# EAGLE design BeaverBoard (EAGLE 5.11)

## Sheet 1 of 5
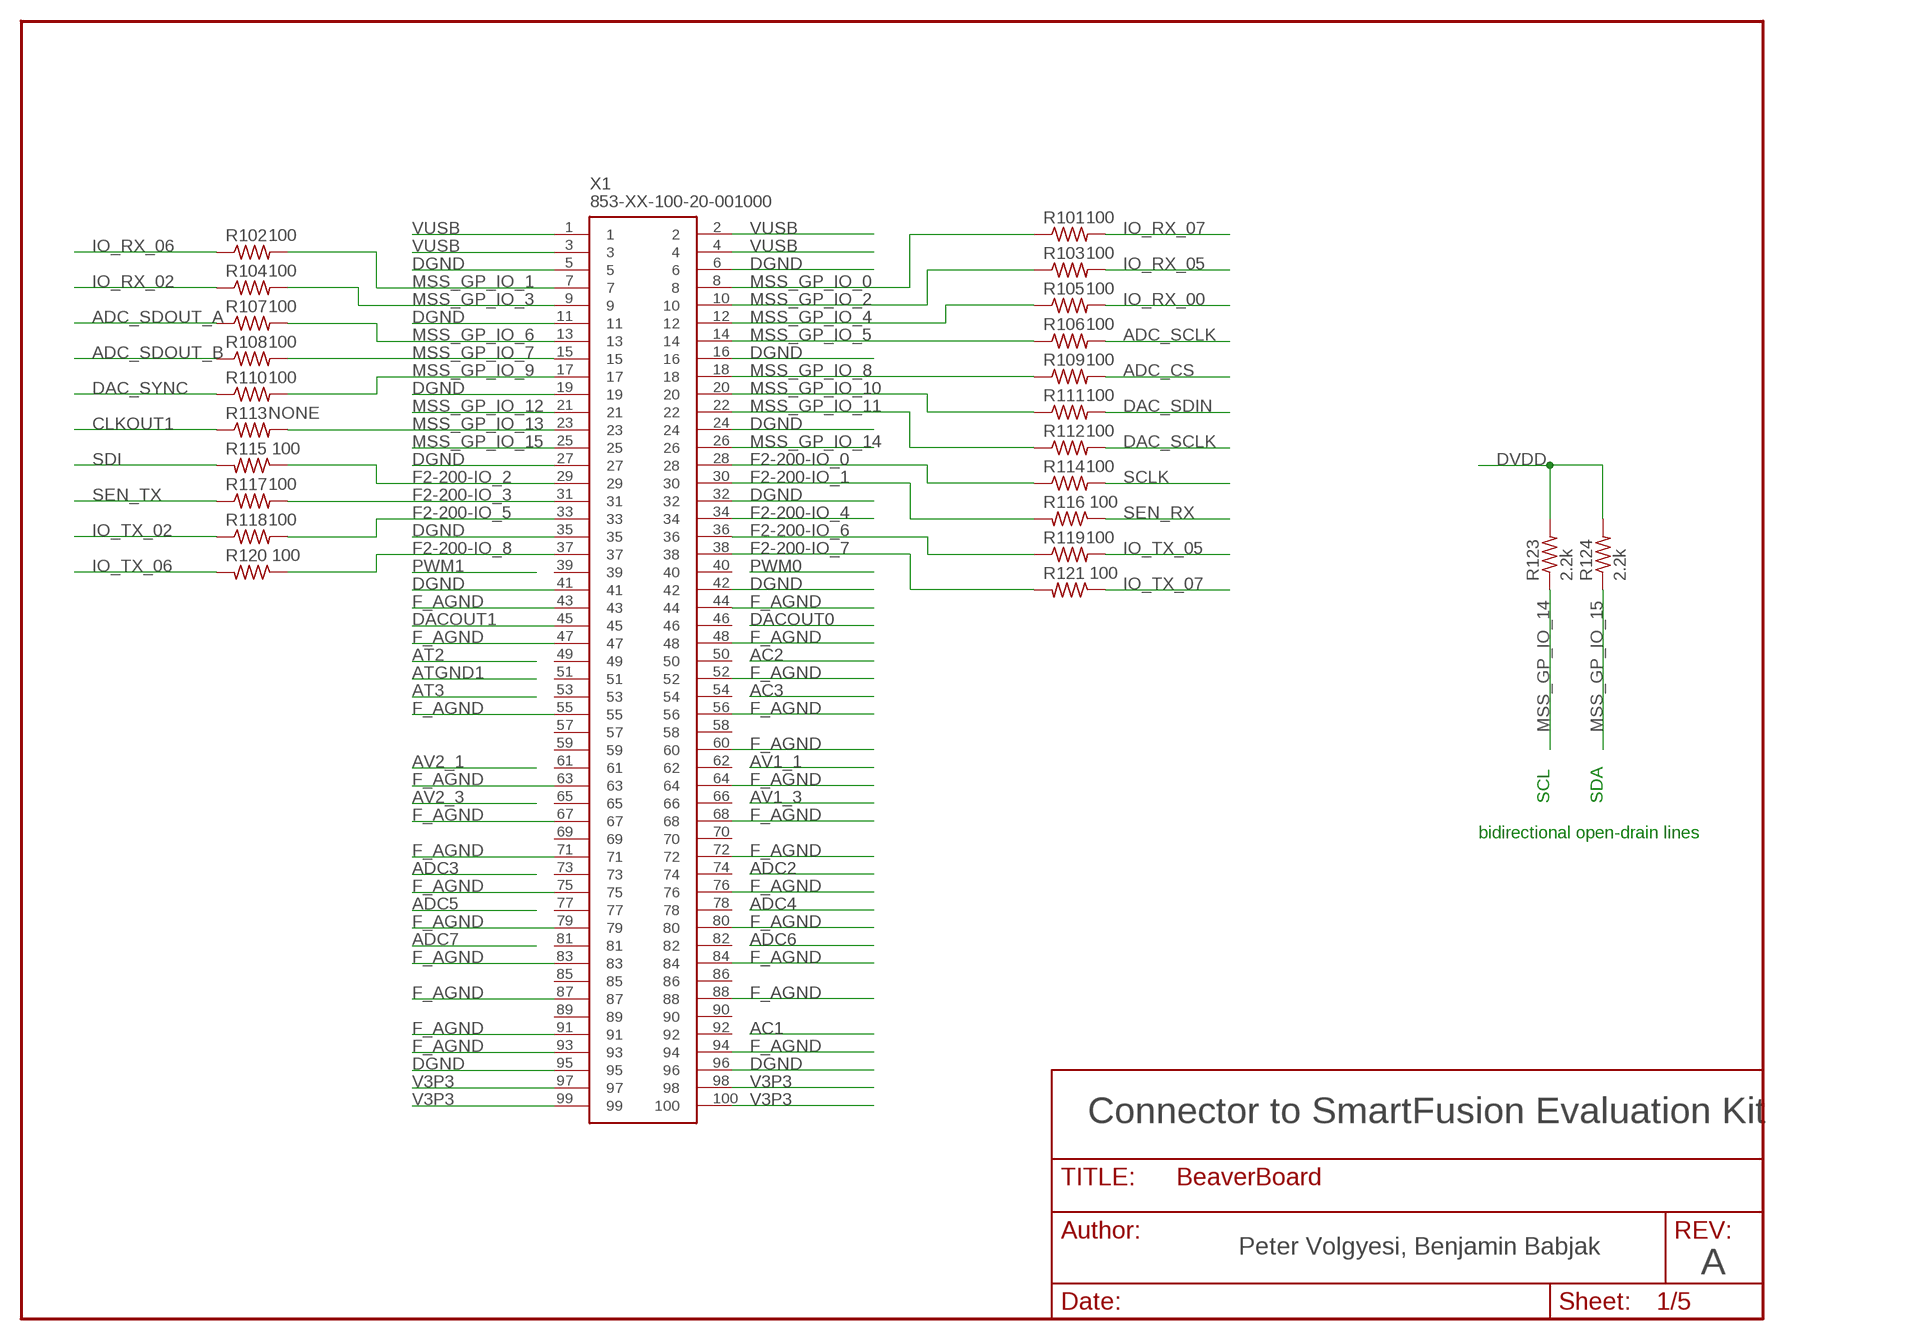
[diagram p0: schematic, sheet 1]

### Parts
R101  100  R0603  [0603]
R102  100  R0603  [0603]
R103  100  R0603  [0603]
R104  100  R0603  [0603]
R105  100  R0603  [0603]
R106  100  R0603  [0603]
R107  100  R0603  [0603]
R108  100  R0603  [0603]
R109  100  R0603  [0603]
R110  100  R0603  [0603]
R111  100  R0603  [0603]
R112  100  R0603  [0603]
R113  NONE  R0603  [0603]
R114  100  R0603  [0603]
R115  100  R0603  [0603]
R116  100  R0603  [0603]
R117  100  R0603  [0603]
R118  100  R0603  [0603]
R119  100  R0603  [0603]
R120  100  R0603  [0603]
R121  100  R0603  [0603]
R123  2.2k  R0603  [0603]
R124  2.2k  R0603  [0603]
X1  853-XX-100-20-001000  [853-XX-100-20-001000]

### Nets
ADC_CS: R109.2 ; also sheet 3
ADC_SCLK: R106.2 ; also sheet 3
ADC_SDOUT_A: R107.1 ; also sheet 3
ADC_SDOUT_B: R108.1 ; also sheet 3
CLKOUT1: R113.1 ; also sheet 2
DAC_SCLK: R112.2 ; also sheet 4
DAC_SDIN: R111.2 ; also sheet 4
DAC_SYNC: R110.1 ; also sheet 4
DACOUT1: X1.45 ; also sheet 2
DGND: X1.5 X1.6 X1.11 X1.16 X1.19 X1.24 X1.27 X1.32 X1.35 X1.41 X1.42 X1.95 X1.96 ; also sheet 2,3,4,5
DVDD: R123.2 R124.2 ; also sheet 2,3,4,5
F2-200-IO_0: R114.1 X1.28
F2-200-IO_1: R116.2 X1.30
F2-200-IO_2: R115.1 X1.29
F2-200-IO_3: R117.2 X1.31
F2-200-IO_4: X1.34
F2-200-IO_5: R118.2 X1.33
F2-200-IO_6: R119.1 X1.36
F2-200-IO_7: R121.2 X1.38
F2-200-IO_8: R120.1 X1.37
F_AGND: X1.43 X1.44 X1.47 X1.48 X1.52 X1.55 X1.56 X1.60 X1.63 X1.64 X1.67 X1.68 X1.71 X1.72 X1.75 X1.76 X1.79 X1.80 X1.83 X1.84 X1.87 X1.88 X1.91 X1.93 X1.94 ; also sheet 5
IO_RX_00: R105.2 ; also sheet 2
IO_RX_02: R104.1 ; also sheet 2
IO_RX_05: R103.2 ; also sheet 2
IO_RX_06: R102.1 ; also sheet 2
IO_RX_07: R101.2 ; also sheet 2
IO_TX_02: R118.1 ; also sheet 2
IO_TX_05: R119.2 ; also sheet 2
IO_TX_06: R120.2 ; also sheet 2
IO_TX_07: R121.1 ; also sheet 2
MSS_GP_IO_0: R101.1 X1.8
MSS_GP_IO_1: R102.2 X1.7
MSS_GP_IO_2: R103.1 X1.10
MSS_GP_IO_3: R104.2 X1.9
MSS_GP_IO_4: R105.1 X1.12
MSS_GP_IO_5: R106.1 X1.14
MSS_GP_IO_6: R107.2 X1.13
MSS_GP_IO_7: R108.2 X1.15
MSS_GP_IO_8: R109.1 X1.18
MSS_GP_IO_9: R110.2 X1.17
MSS_GP_IO_10: R111.1 X1.20
MSS_GP_IO_11: R112.1 X1.22
MSS_GP_IO_12: X1.21
MSS_GP_IO_13: R113.2 X1.23
MSS_GP_IO_14: R123.1 X1.26 ; also sheet 2
MSS_GP_IO_15: R124.1 X1.25 ; also sheet 2
SCLK: R114.2 ; also sheet 2
SDI: R115.2 ; also sheet 2
SEN_RX: R116.1 ; also sheet 2
SEN_TX: R117.1 ; also sheet 2
V3P3: X1.97 X1.98 X1.99 X1.100
VUSB: X1.1 X1.2 X1.3 X1.4 ; also sheet 5
Unconnected: X1.39 X1.40 X1.46 X1.49 X1.50 X1.51 X1.53 X1.54 X1.57 X1.58 X1.59 X1.61 X1.62 X1.65 X1.66 X1.69 X1.70 X1.73 X1.74 X1.77 X1.78 X1.81 X1.82 X1.85 X1.86 X1.89 X1.90 X1.92

### Notes on the sheet
- SCL | SDA
- bidirectional open-drain lines
- Connector to SmartFusion Evaluation Kit
- Peter Volgyesi, Benjamin Babjak
- A

## Sheet 2 of 5
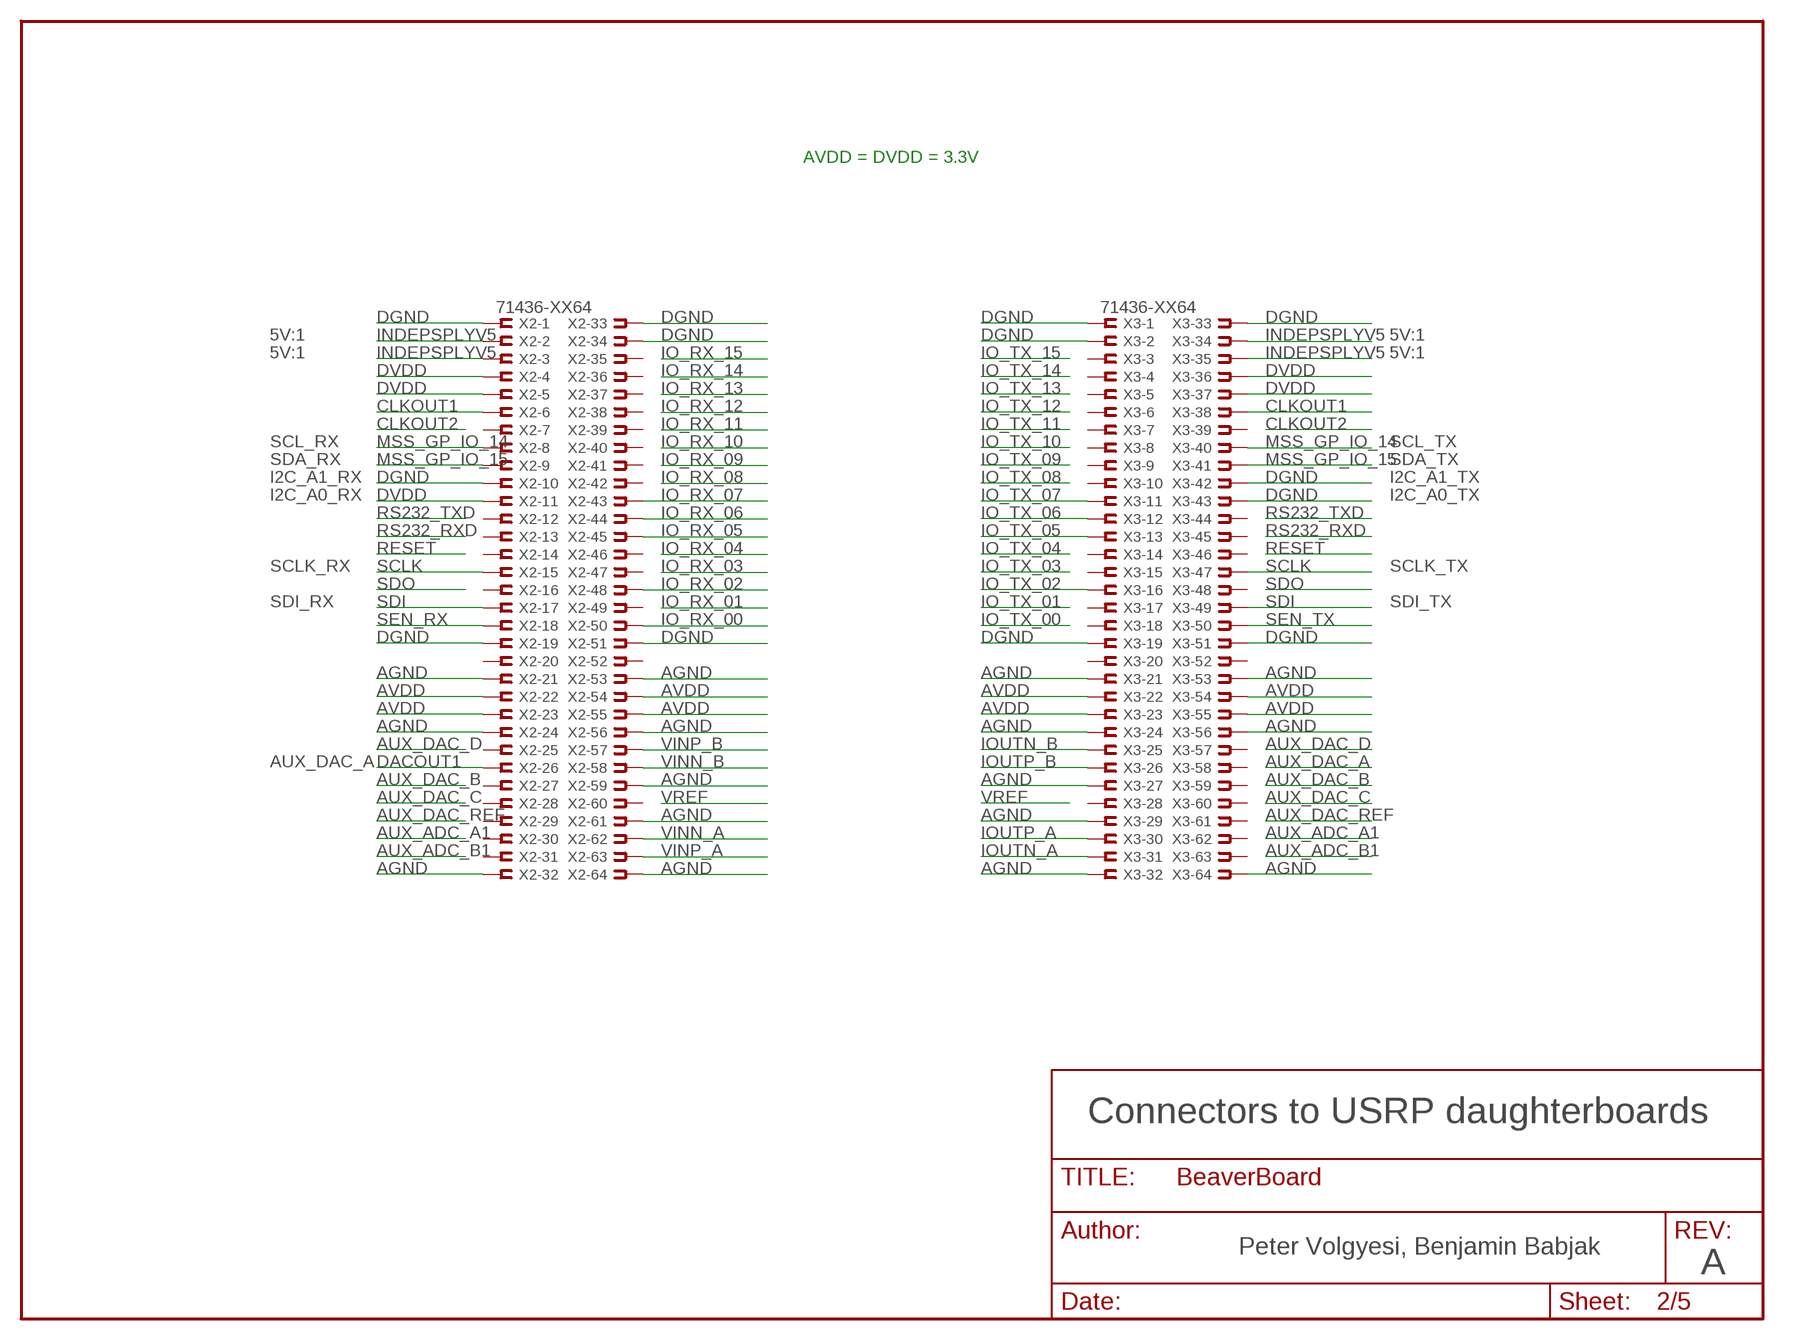
[diagram p1: schematic, sheet 2]

### Parts
X2  71436-XX64  [71436-XX64]
X3  71436-XX64  [71436-XX64]

### Nets
AGND: X2.21 X2.24 X2.32 X2.53 X2.56 X2.59 X2.61 X2.64 X3.21 X3.24 X3.27 X3.29 X3.32 X3.53 X3.56 X3.64 ; also sheet 3,4,5
AVDD: X2.22 X2.23 X2.54 X2.55 X3.22 X3.23 X3.54 X3.55 ; also sheet 3,4,5
CLKOUT1: X2.6 X3.38 ; also sheet 1
DACOUT1: X2.26 ; also sheet 1
DGND: X2.1 X2.10 X2.19 X2.33 X2.34 X2.51 X3.1 X3.2 X3.19 X3.33 X3.42 X3.43 X3.51 ; also sheet 1,3,4,5
DVDD: X2.4 X2.5 X2.11 X3.36 X3.37 ; also sheet 1,3,4,5
INDEPSPLYV5: X2.2 X2.3 X3.34 X3.35 ; also sheet 5
IO_RX_00: X2.50 ; also sheet 1
IO_RX_02: X2.48 ; also sheet 1
IO_RX_05: X2.45 ; also sheet 1
IO_RX_06: X2.44 ; also sheet 1
IO_RX_07: X2.43 ; also sheet 1
IO_TX_02: X3.16 ; also sheet 1
IO_TX_05: X3.13 ; also sheet 1
IO_TX_06: X3.12 ; also sheet 1
IO_TX_07: X3.11 ; also sheet 1
IOUTN_A: X3.31 ; also sheet 4
IOUTN_B: X3.25 ; also sheet 4
IOUTP_A: X3.30 ; also sheet 4
IOUTP_B: X3.26 ; also sheet 4
MSS_GP_IO_14: X2.8 X3.40 ; also sheet 1
MSS_GP_IO_15: X2.9 X3.41 ; also sheet 1
SCLK: X2.15 X3.47 ; also sheet 1
SDI: X2.17 X3.49 ; also sheet 1
SEN_RX: X2.18 ; also sheet 1
SEN_TX: X3.50 ; also sheet 1
VINN_A: X2.62 ; also sheet 3
VINN_B: X2.58 ; also sheet 3
VINP_A: X2.63 ; also sheet 3
VINP_B: X2.57 ; also sheet 3
Unconnected: X2.7 X2.12 X2.13 X2.14 X2.16 X2.20 X2.25 X2.27 X2.28 X2.29 X2.30 X2.31 X2.35 X2.36 X2.37 X2.38 X2.39 X2.40 X2.41 X2.42 X2.46 X2.47 X2.49 X2.52 X2.60 X3.3 X3.4 X3.5 X3.6 X3.7 X3.8 X3.9 X3.10 X3.14 X3.15 X3.17 X3.18 X3.20 X3.28 X3.39 X3.44 X3.45 X3.46 X3.48 X3.52 X3.57 X3.58 X3.59 X3.60 X3.61 X3.62 X3.63

### Notes on the sheet
- AVDD = DVDD = 3.3V
- 5V:1 | 5V:1
- 5V:1 | 5V:1
- SCL_RX | SCL_TX
- SDA_RX | SDA_TX
- I2C_A1_RX | I2C_A1_TX
- I2C_A0_RX | I2C_A0_TX
- SCLK_RX | SCLK_TX
- SDI_RX | SDI_TX
- AUX_DAC_A
- Connectors to USRP daughterboards
- Peter Volgyesi, Benjamin Babjak
- A

## Sheet 3 of 5
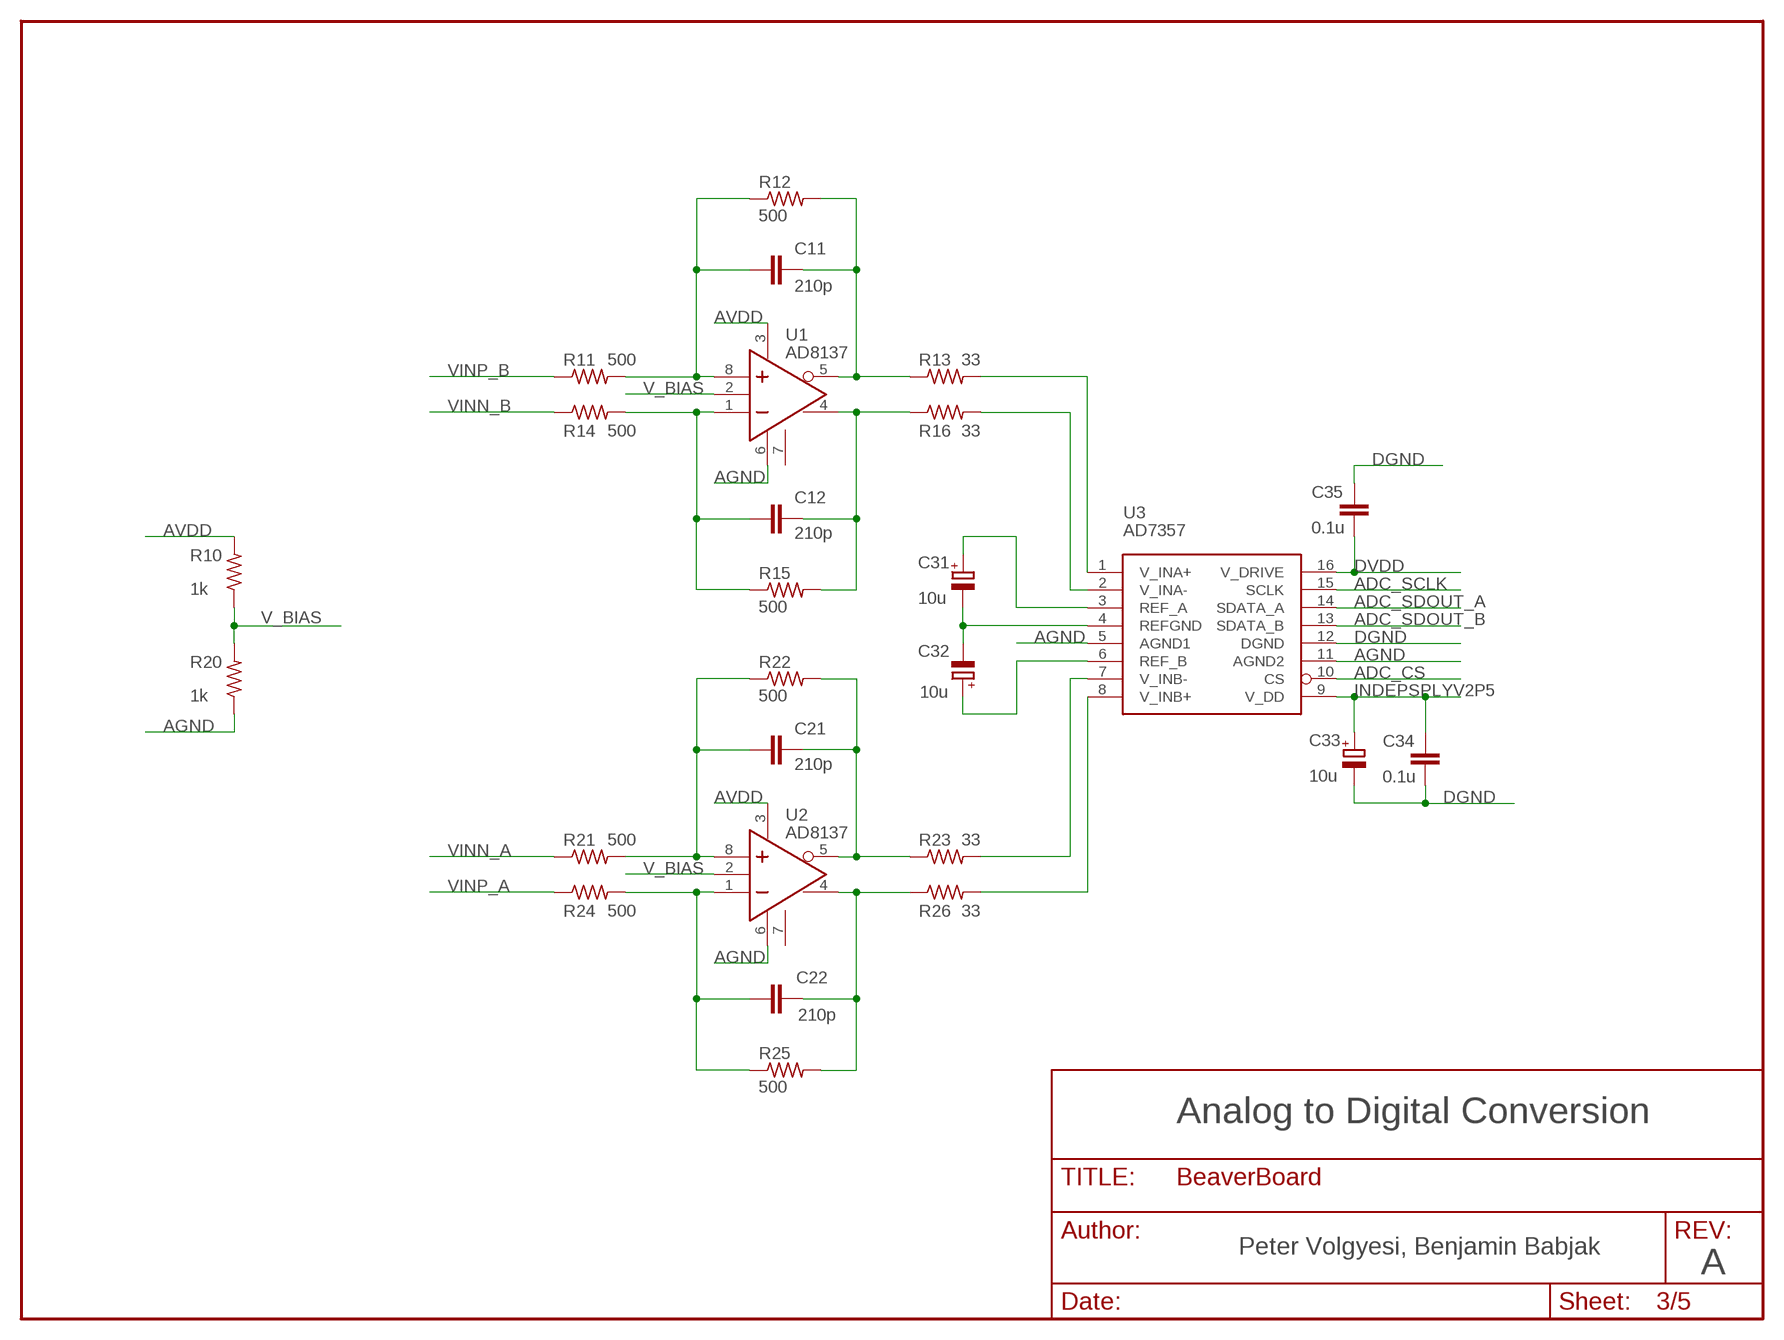
[diagram p2: schematic, sheet 3]

### Parts
C11  210p  C0603  [0603]
C12  210p  C0603  [0603]
C21  210p  C0603  [0603]
C22  210p  C0603  [0603]
C31  10u  CPOL3216  [C3216]
C32  10u  CPOL3216  [C3216]
C33  10u  CPOL3216  [C3216]
C34  0.1u  C0603  [0603]
C35  0.1u  C0603  [0603]
R10  1k  R0603  [0603]
R11  500  R0603  [0603]
R12  500  R0603  [0603]
R13  33  R0603  [0603]
R14  500  R0603  [0603]
R15  500  R0603  [0603]
R16  33  R0603  [0603]
R20  1k  R0603  [0603]
R21  500  R0603  [0603]
R22  500  R0603  [0603]
R23  33  R0603  [0603]
R24  500  R0603  [0603]
R25  500  R0603  [0603]
R26  33  R0603  [0603]
U1  AD8137  [SOIC8]
U2  AD8137  [SOIC8]
U3  AD7357  [TSSOP16]

### Nets
ADC_CS: U3.10(CS) ; also sheet 1
ADC_SCLK: U3.15(SCLK) ; also sheet 1
ADC_SDOUT_A: U3.14(SDATA_A) ; also sheet 1
ADC_SDOUT_B: U3.13(SDATA_B) ; also sheet 1
AGND: R20.1 U1.6(V_S-) U2.6(V_S-) U3.5(AGND1) U3.11(AGND2) ; also sheet 2,4,5
AVDD: R10.2 U1.3(V_S+) U2.3(V_S+) ; also sheet 2,4,5
DGND: C33.2(-) C34.2 C35.1 U3.12(DGND) ; also sheet 1,2,4,5
DVDD: C35.2 U3.16(V_DRIVE) ; also sheet 1,2,4,5
INDEPSPLYV2P5: C33.1(+) C34.1 U3.9(V_DD) ; also sheet 5
N$4: R13.2 U3.1(V_INA+)
N$6: C11.2 R12.2 R13.1 U1.5(-OUT)
N$7: C12.2 R15.2 R16.1 U1.4(+OUT)
N$8: C11.1 R11.2 R12.1 U1.8(+IN)
N$9: C12.1 R14.2 R15.1 U1.1(-IN)
N$10: C21.2 R22.2 R23.1 U2.5(-OUT)
N$11: C21.1 R21.2 R22.1 U2.8(+IN)
N$12: C22.1 R24.2 R25.1 U2.1(-IN)
N$13: C22.2 R25.2 R26.1 U2.4(+OUT)
N$30: R26.2 U3.8(V_INB+)
N$31: C31.1(+) U3.3(REF_A)
N$39: R23.2 U3.7(V_INB-)
N$40: R16.2 U3.2(V_INA-)
S$2: C31.2(-) C32.2(-) U3.4(REFGND)
S$3: C32.1(+) U3.6(REF_B)
V_BIAS: R10.1 R20.2 U1.2(V_OCM) U2.2(V_OCM)
VINN_A: R21.1 ; also sheet 2
VINN_B: R14.1 ; also sheet 2
VINP_A: R24.1 ; also sheet 2
VINP_B: R11.1 ; also sheet 2
Unconnected: U1.7(PD) U2.7(PD)

### Notes on the sheet
- Analog to Digital Conversion
- Peter Volgyesi, Benjamin Babjak
- A

## Sheet 4 of 5
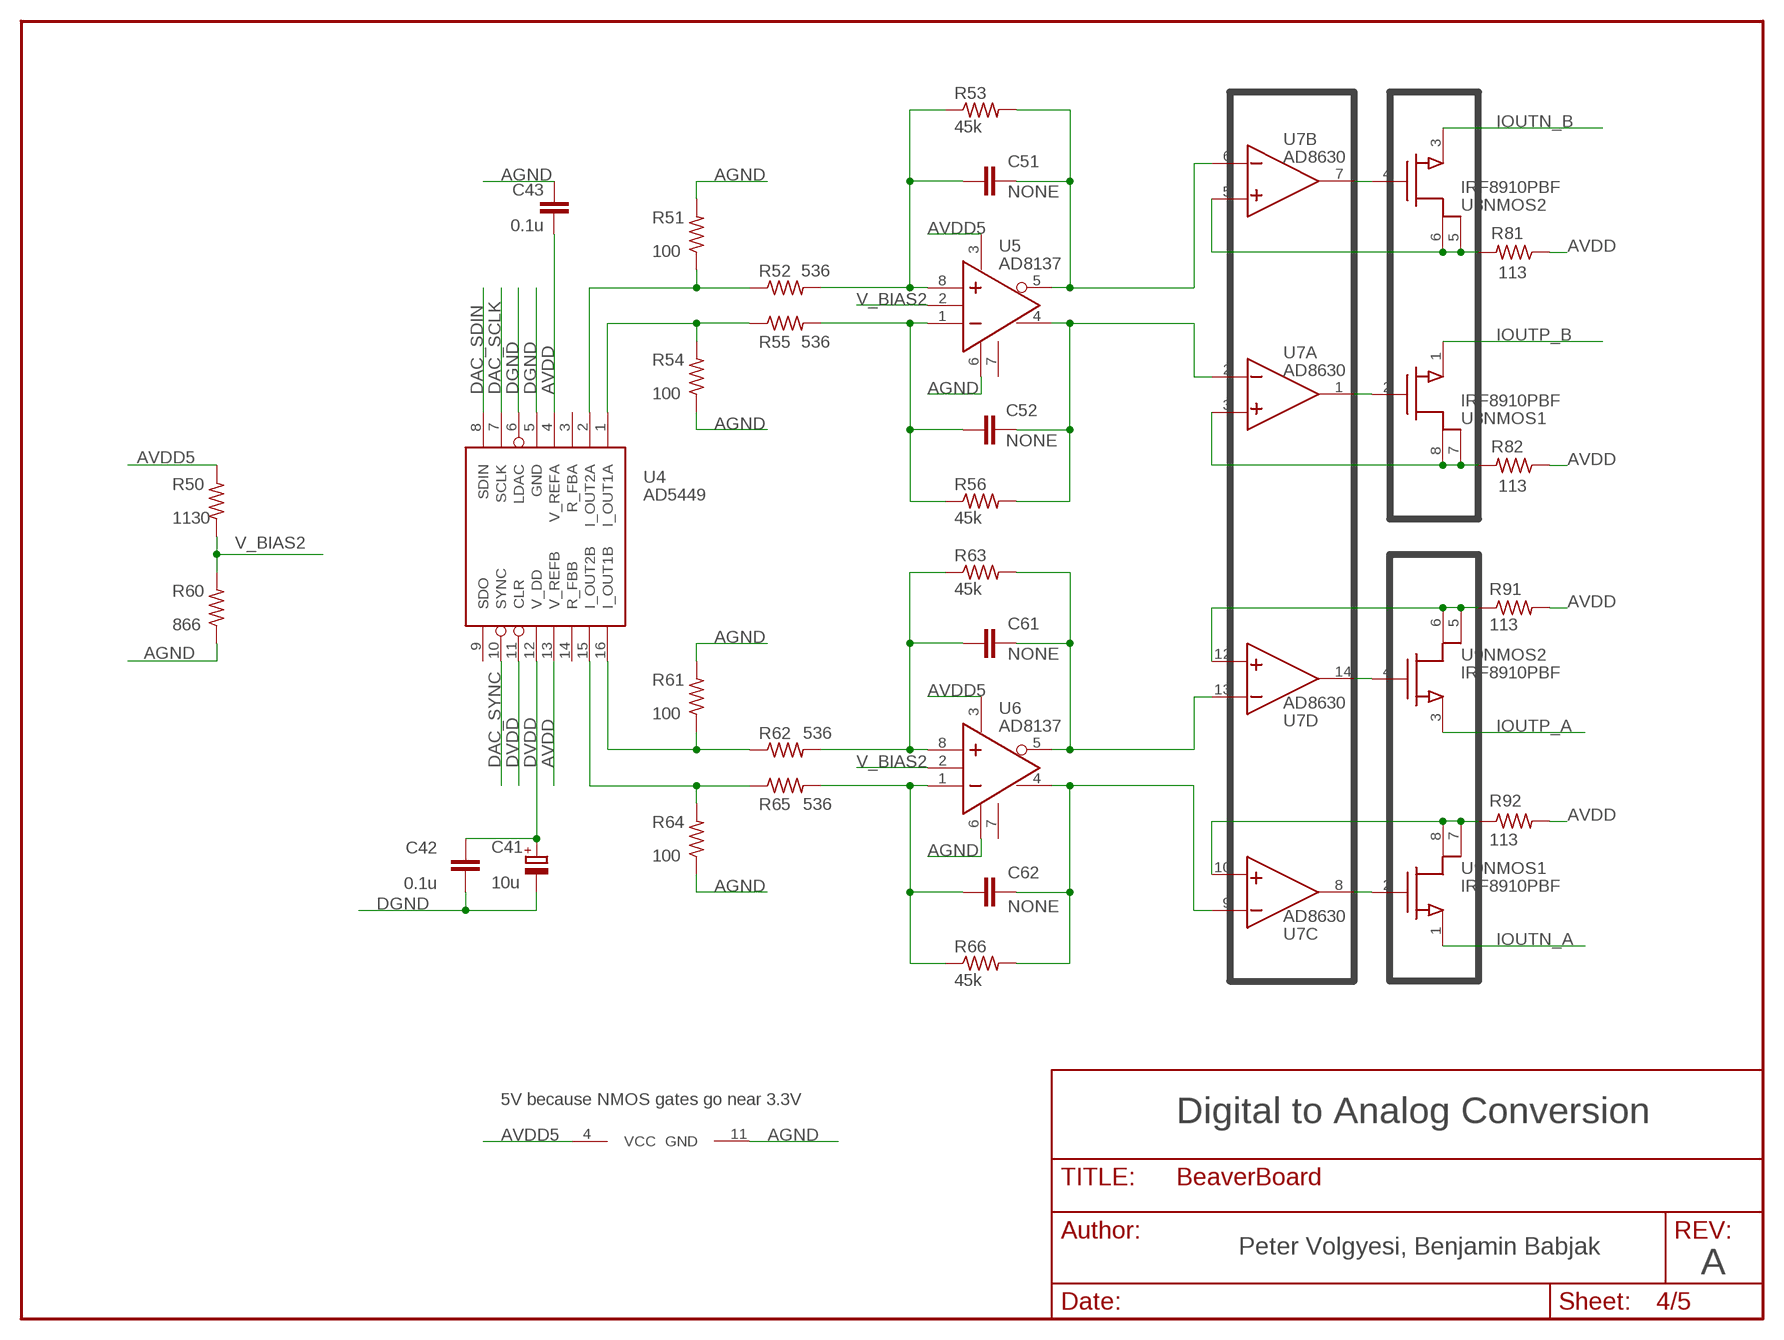
[diagram p3: schematic, sheet 4]

### Parts
C41  10u  CPOL3216  [C3216]
C42  0.1u  C0603  [0603]
C43  0.1u  C0603  [0603]
C51  NONE  C0603  [0603]
C52  NONE  C0603  [0603]
C61  NONE  C0603  [0603]
C62  NONE  C0603  [0603]
R50  1130  R0603  [0603]
R51  100  R0603  [0603]
R52  536  R0603  [0603]
R53  45k  R0603  [0603]
R54  100  R0603  [0603]
R55  536  R0603  [0603]
R56  45k  R0603  [0603]
R60  866  R0603  [0603]
R61  100  R0603  [0603]
R62  536  R0603  [0603]
R63  45k  R0603  [0603]
R64  100  R0603  [0603]
R65  536  R0603  [0603]
R66  45k  R0603  [0603]
R81  113  R0603  [0603]
R82  113  R0603  [0603]
R91  113  R0603  [0603]
R92  113  R0603  [0603]
U4  AD5449  [TSSOP16]
U5  AD8137  [SOIC8]
U6  AD8137  [SOIC8]
U7  AD8630  [SO14]
U8  IRF8910PBF  [SOIC8]
U9  IRF8910PBF  [SOIC8]

### Nets
AGND: C43.1 R51.2 R54.1 R60.1 R61.2 R64.1 U5.6(V_S-) U6.6(V_S-) U7.11(S:GND) ; also sheet 2,3,5
AVDD: C43.2 R81.1 R82.1 R91.2 R92.2 U4.4(V_REFA) U4.13(V_REFB) ; also sheet 2,3,5
AVDD5: R50.2 U5.3(V_S+) U6.3(V_S+) U7.4(S:VCC) ; also sheet 5
DAC_SCLK: U4.7(SCLK) ; also sheet 1
DAC_SDIN: U4.8(SDIN) ; also sheet 1
DAC_SYNC: U4.10(SYNC) ; also sheet 1
DGND: C41.2(-) C42.1 U4.5(GND) U4.6(LDAC) ; also sheet 1,2,3,5
DVDD: C41.1(+) C42.2 U4.11(CLR) U4.12(V_DD) ; also sheet 1,2,3,5
IOUTN_A: U9.1(NMOS1:S) ; also sheet 2
IOUTN_B: U8.3(NMOS2:S) ; also sheet 2
IOUTP_A: U9.3(NMOS2:S) ; also sheet 2
IOUTP_B: U8.1(NMOS1:S) ; also sheet 2
N$1: C61.2 R63.2 U6.5(-OUT) U7.13(D:N)
N$2: R81.2 U7.5(B:P) U8.5(NMOS2:D2) U8.6(NMOS2:D1)
N$5: C51.2 R53.2 U5.5(-OUT) U7.6(B:N)
N$14: U7.7(B:O) U8.4(NMOS2:G)
N$15: C52.2 R56.2 U5.4(+OUT) U7.2(A:N)
N$16: C62.2 R66.2 U6.4(+OUT) U7.9(C:N)
N$17: C61.1 R62.2 R63.1 U6.8(+IN)
N$18: C62.1 R65.2 R66.1 U6.1(-IN)
N$19: C51.1 R52.2 R53.1 U5.8(+IN)
N$20: C52.1 R55.2 R56.1 U5.1(-IN)
N$21: R51.1 R52.1 U4.2(I_OUT2A)
N$22: R82.2 U7.3(A:P) U8.7(NMOS1:D2) U8.8(NMOS1:D1)
N$23: R64.2 R65.1 U4.15(I_OUT2B)
N$24: R61.1 R62.1 U4.16(I_OUT1B)
N$25: R54.2 R55.1 U4.1(I_OUT1A)
N$26: U7.1(A:O) U8.2(NMOS1:G)
N$27: U7.14(D:O) U9.4(NMOS2:G)
N$28: U7.8(C:O) U9.2(NMOS1:G)
N$33: R91.1 U7.12(D:P) U9.5(NMOS2:D2) U9.6(NMOS2:D1)
N$34: R92.1 U7.10(C:P) U9.7(NMOS1:D2) U9.8(NMOS1:D1)
V_BIAS2: R50.1 R60.2 U5.2(V_OCM) U6.2(V_OCM)
Unconnected: U4.3(R_FBA) U4.9(SDO) U4.14(R_FBB) U5.7(PD) U6.7(PD)

### Notes on the sheet
- 5V because NMOS gates go near 3.3V
- Digital to Analog Conversion
- Peter Volgyesi, Benjamin Babjak
- A

## Sheet 5 of 5
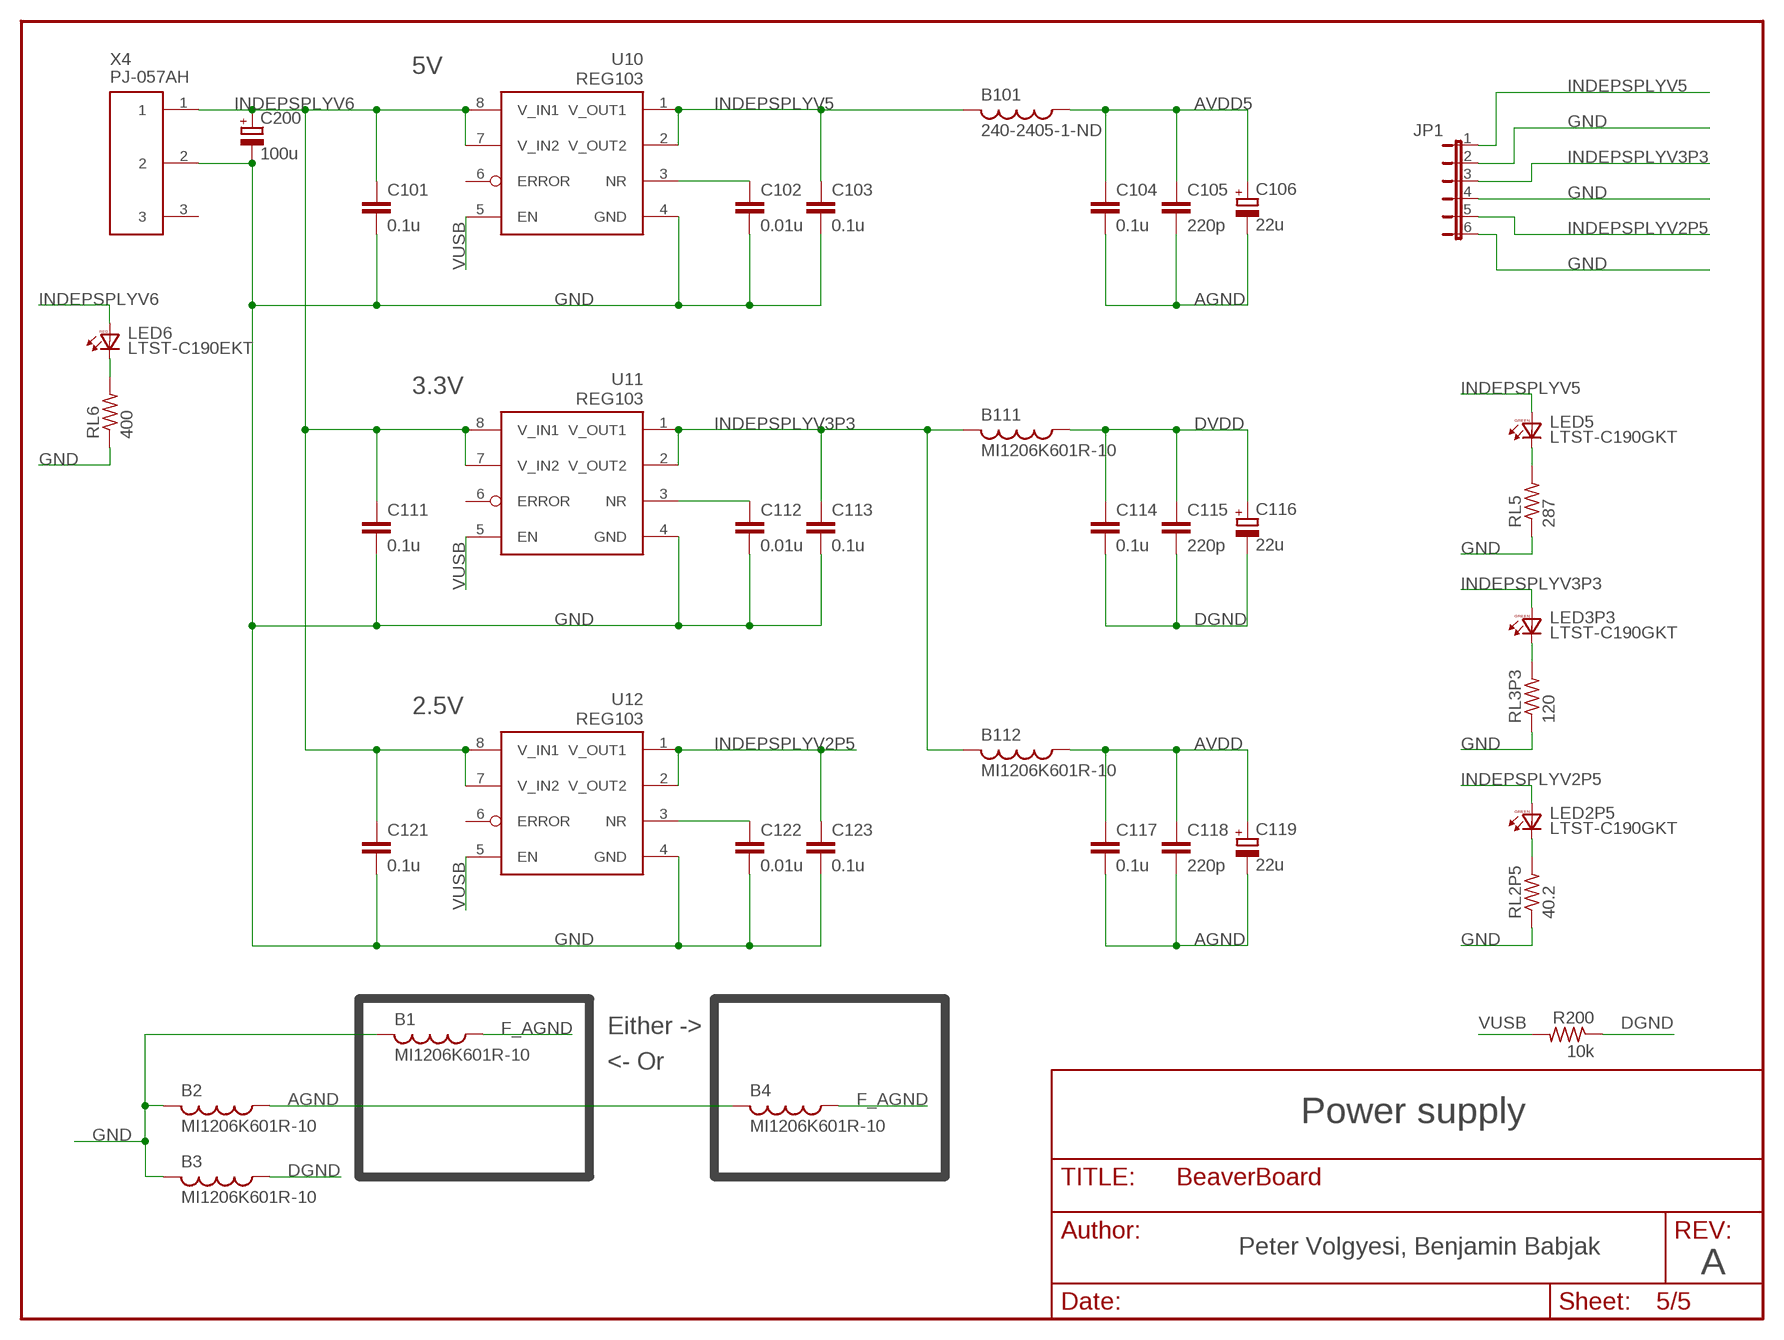
[diagram p4: schematic, sheet 5]

### Parts
B1  MI1206K601R-10  BEAD1206  [1206]
B2  MI1206K601R-10  BEAD1206  [1206]
B3  MI1206K601R-10  BEAD1206  [1206]
B4  MI1206K601R-10  BEAD1206  [1206]
B101  240-2405-1-ND  BEAD1206  [1206]
B111  MI1206K601R-10  BEAD1206  [1206]
B112  MI1206K601R-10  BEAD1206  [1206]
C101  0.1u  C0603  [0603]
C102  0.01u  C0603  [0603]
C103  0.1u  C0603  [0603]
C104  0.1u  C0603  [0603]
C105  220p  C0603  [0603]
C106  22u  CPOL3216  [C3216]
C111  0.1u  C0603  [0603]
C112  0.01u  C0603  [0603]
C113  0.1u  C0603  [0603]
C114  0.1u  C0603  [0603]
C115  220p  C0603  [0603]
C116  22u  CPOL3216  [C3216]
C117  0.1u  C0603  [0603]
C118  220p  C0603  [0603]
C119  22u  CPOL3216  [C3216]
C121  0.1u  C0603  [0603]
C122  0.01u  C0603  [0603]
C123  0.1u  C0603  [0603]
C200  100u  CPOL3216  [C3216]
JP1  JP6E  [JP6]
LED2P5  LTST-C190GKT  [0603]
LED3P3  LTST-C190GKT  [0603]
LED5  LTST-C190GKT  [0603]
LED6  LTST-C190EKT  [0603]
R200  10k  R0603  [0603]
RL2P5  40.2  R0603  [0603]
RL3P3  120  R0603  [0603]
RL5  287  R0603  [0603]
RL6  400  R0603  [0603]
U10  REG103  [SOIC8]
U11  REG103  [SOIC8]
U12  REG103  [SOIC8]
X4  PJ-057AH  [PJ-057AH]

### Nets
AGND: B2.1 B4.2 C104.2 C105.2 C106.2(-) C117.2 C118.2 C119.2(-) ; also sheet 2,3,4
AVDD: B112.1 C117.1 C118.1 C119.1(+) ; also sheet 2,3,4
AVDD5: B101.1 C104.1 C105.1 C106.1(+) ; also sheet 4
DGND: B3.1 C114.2 C115.2 C116.2(-) R200.1 ; also sheet 1,2,3,4
DVDD: B111.1 C114.1 C115.1 C116.1(+) ; also sheet 1,2,3,4
F_AGND: B1.1 B4.1 ; also sheet 1
GND: B1.2 B2.2 B3.2 C101.2 C102.2 C103.2 C111.2 C112.2 C113.2 C121.2 C122.2 C123.2 C200.2(-) JP1.2 JP1.4 JP1.6 RL2P5.1 RL3P3.1 RL5.1 RL6.1 U10.4(GND) U11.4(GND) U12.4(GND) X4.2
INDEPSPLYV2P5: C123.1 JP1.5 LED2P5.1(A) U12.1(V_OUT1) U12.2(V_OUT2) ; also sheet 3
INDEPSPLYV3P3: B111.2 B112.2 C113.1 JP1.3 LED3P3.1(A) U11.1(V_OUT1) U11.2(V_OUT2)
INDEPSPLYV5: B101.2 C103.1 JP1.1 LED5.1(A) U10.1(V_OUT1) U10.2(V_OUT2) ; also sheet 2
INDEPSPLYV6: C101.1 C111.1 C121.1 C200.1(+) LED6.1(A) U10.7(V_IN2) U10.8(V_IN1) U11.7(V_IN2) U11.8(V_IN1) U12.7(V_IN2) U12.8(V_IN1) X4.1
N$3: LED2P5.2(C) RL2P5.2
N$29: LED3P3.2(C) RL3P3.2
N$32: C102.1 U10.3(NR)
N$36: C112.1 U11.3(NR)
N$37: C122.1 U12.3(NR)
N$38: LED5.2(C) RL5.2
N$41: LED6.2(C) RL6.2
VUSB: R200.2 U10.5(EN) U11.5(EN) U12.5(EN) ; also sheet 1
Unconnected: U10.6(ERROR) U11.6(ERROR) U12.6(ERROR) X4.3

### Notes on the sheet
- 5V
- 3.3V
- 2.5V
- Either ->
- <- Or
- Power supply
- Peter Volgyesi, Benjamin Babjak
- A

## Library data of the parts
B1-B4 B101 B111 B112 = BeaverBoard:BEAD: FERRITE BEAD
C11 C12 C21 C22 C34 C35 C42 C43 C51 C52 C61 C62 C101-C105 C111-C115 C117 C118 C121-C123 = BeaverBoard:C: CAPACITOR, European symbol
C31-C33 C41 C106 C116 C119 C200 = BeaverBoard:CPOL: Capacitor (polarized)
JP1 = BeaverBoard:JP6E: JUMPER
LED2P5 LED3P3 LED5 = BeaverBoard:LTST-C190GKT: Green LED
LED6 = BeaverBoard:LTST-C190EKT: Red LED
R10-R16 R20-R26 R50-R56 R60-R66 R81 R82 R91 R92 R101-R121 R123 R124 R200 RL2P5 RL3P3 RL5 RL6 = BeaverBoard:R: RESISTOR, American symbol
U1 U2 U5 U6 = BeaverBoard:AD8137
U3 = BeaverBoard:AD7357
U4 = BeaverBoard:AD5449
U7 = BeaverBoard:AD8630
U8 U9 = BeaverBoard:IRF8910PBF
U10-U12 = BeaverBoard:REG103
X1 = BeaverBoard:853-XX-100-20-001000
X2 X3 = BeaverBoard:71436-XX64: Board-to-Board Connector 1.00mm (.039") Mezzanine IEEE 1386 Plug - Dual Row, SMT, Vertical Stacking Source: http://www.molex.com/product/micro/71436.html
X4 = BeaverBoard:PJ-057AH

## Board
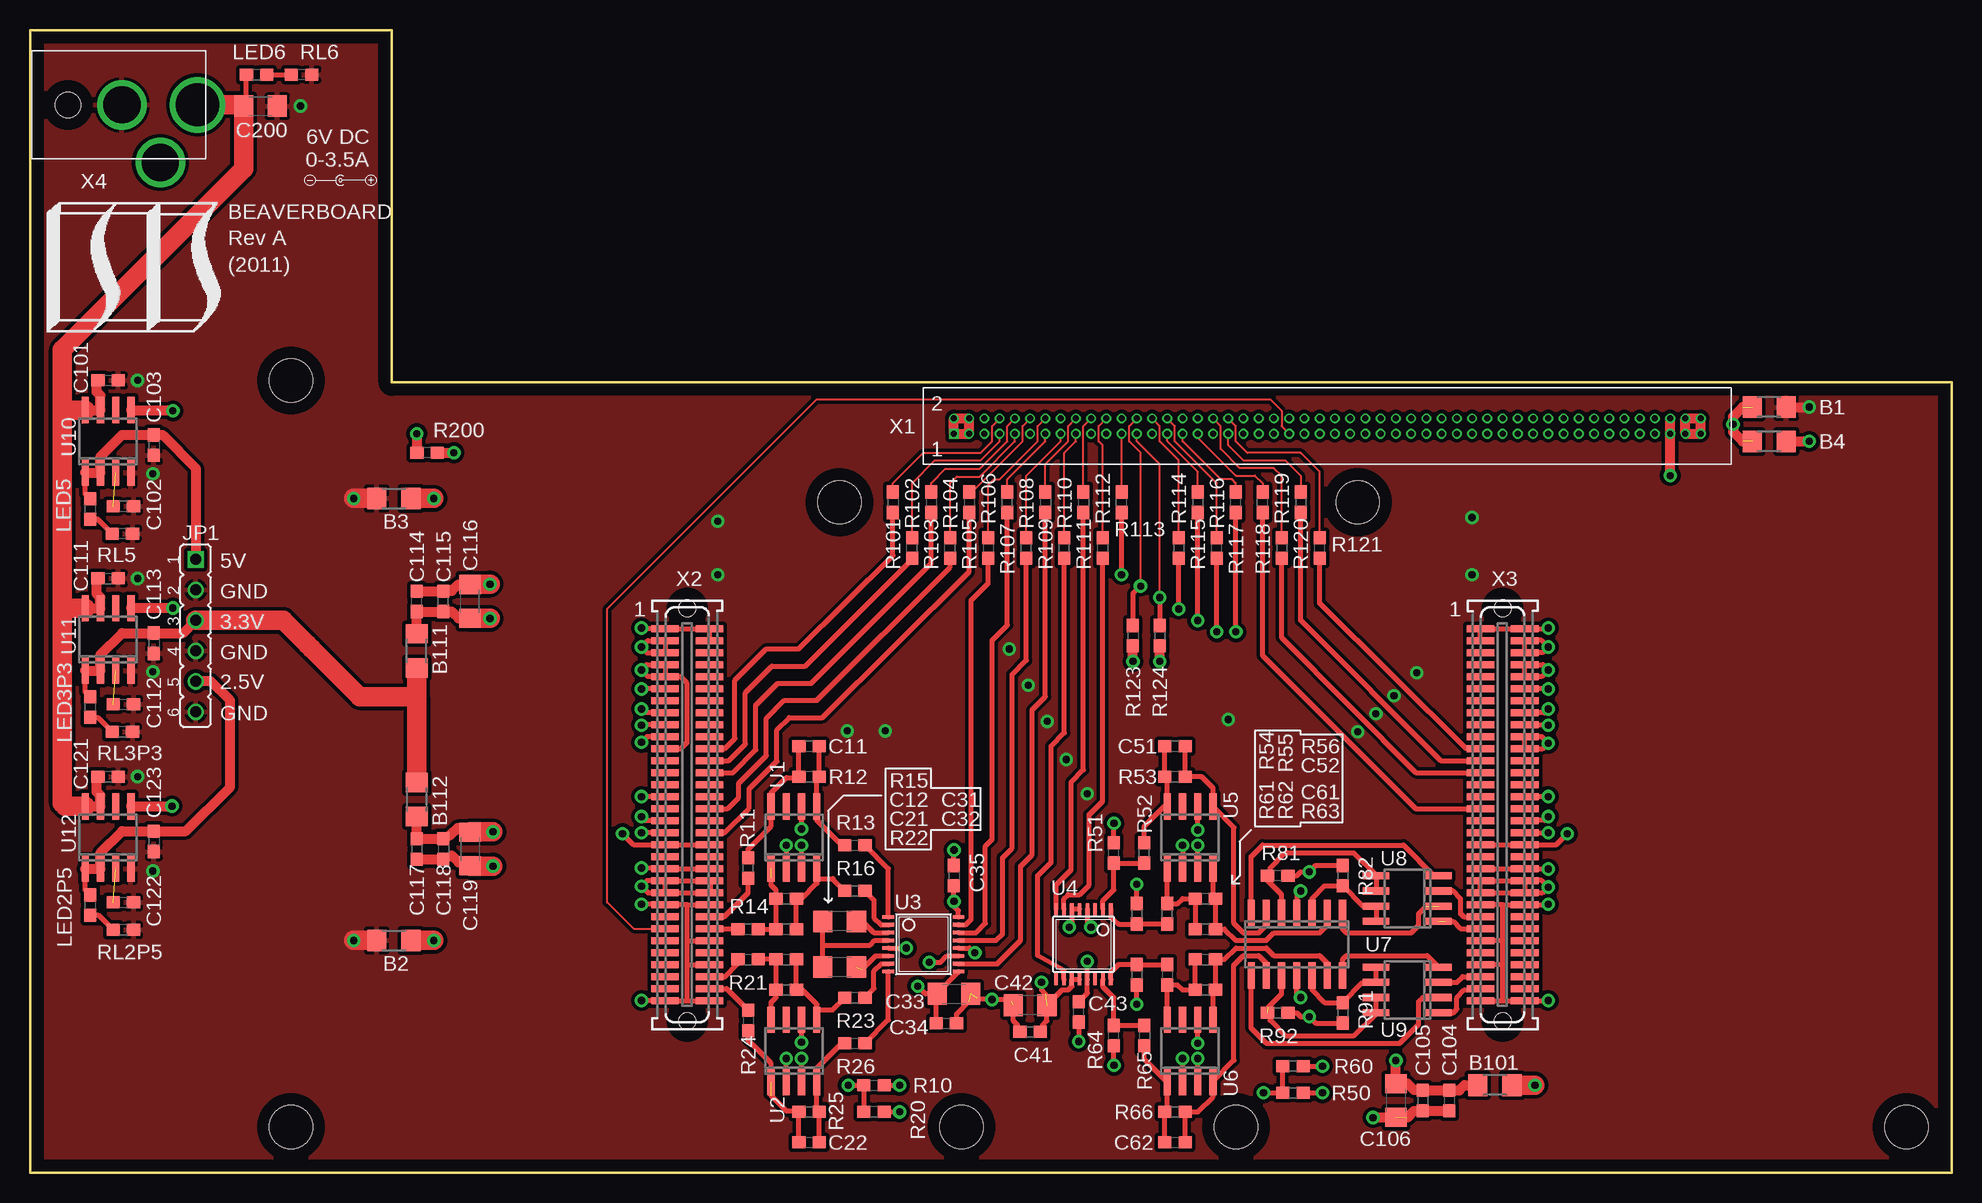
[diagram p5: board, top side]
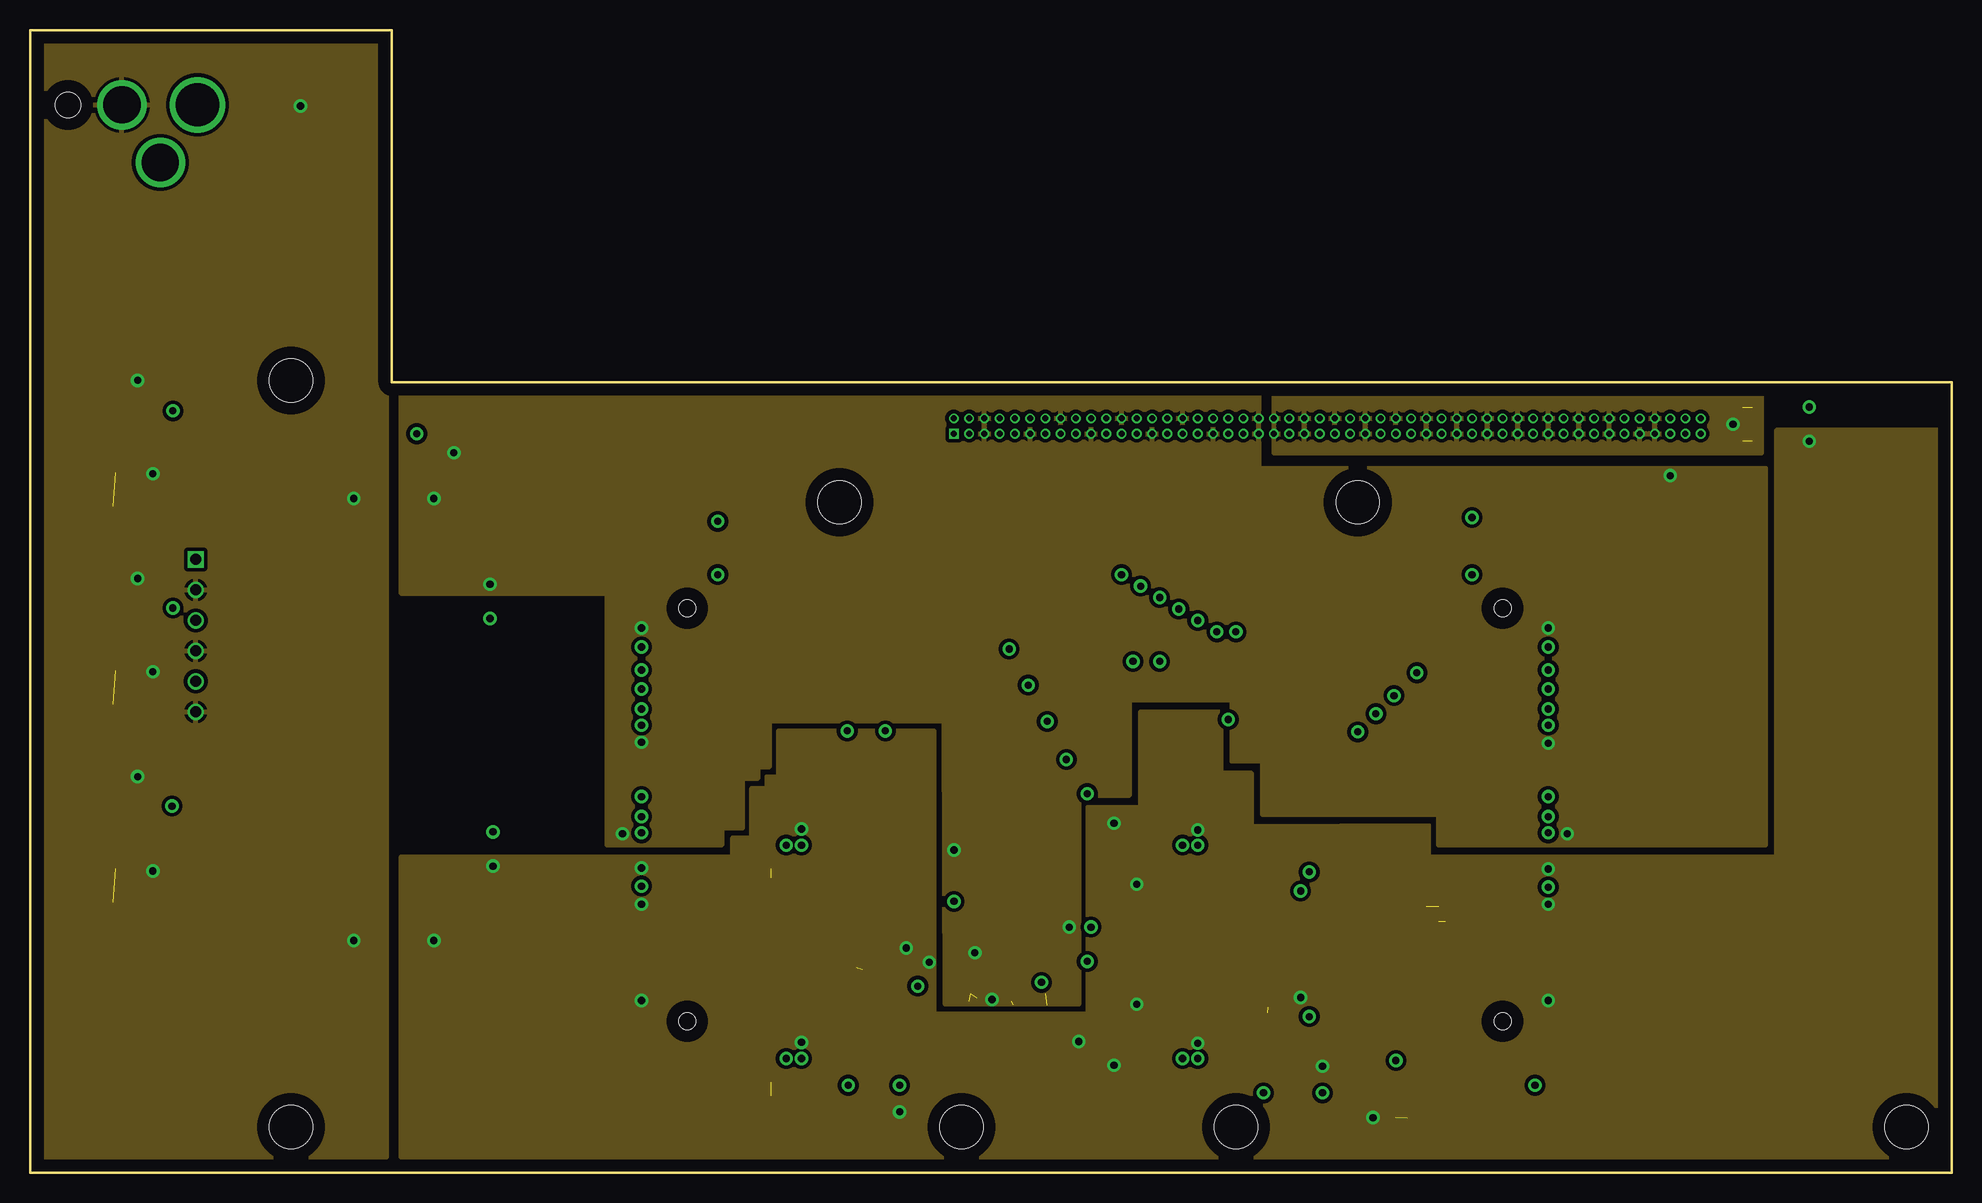
[diagram p6: board, inner layer Route2]
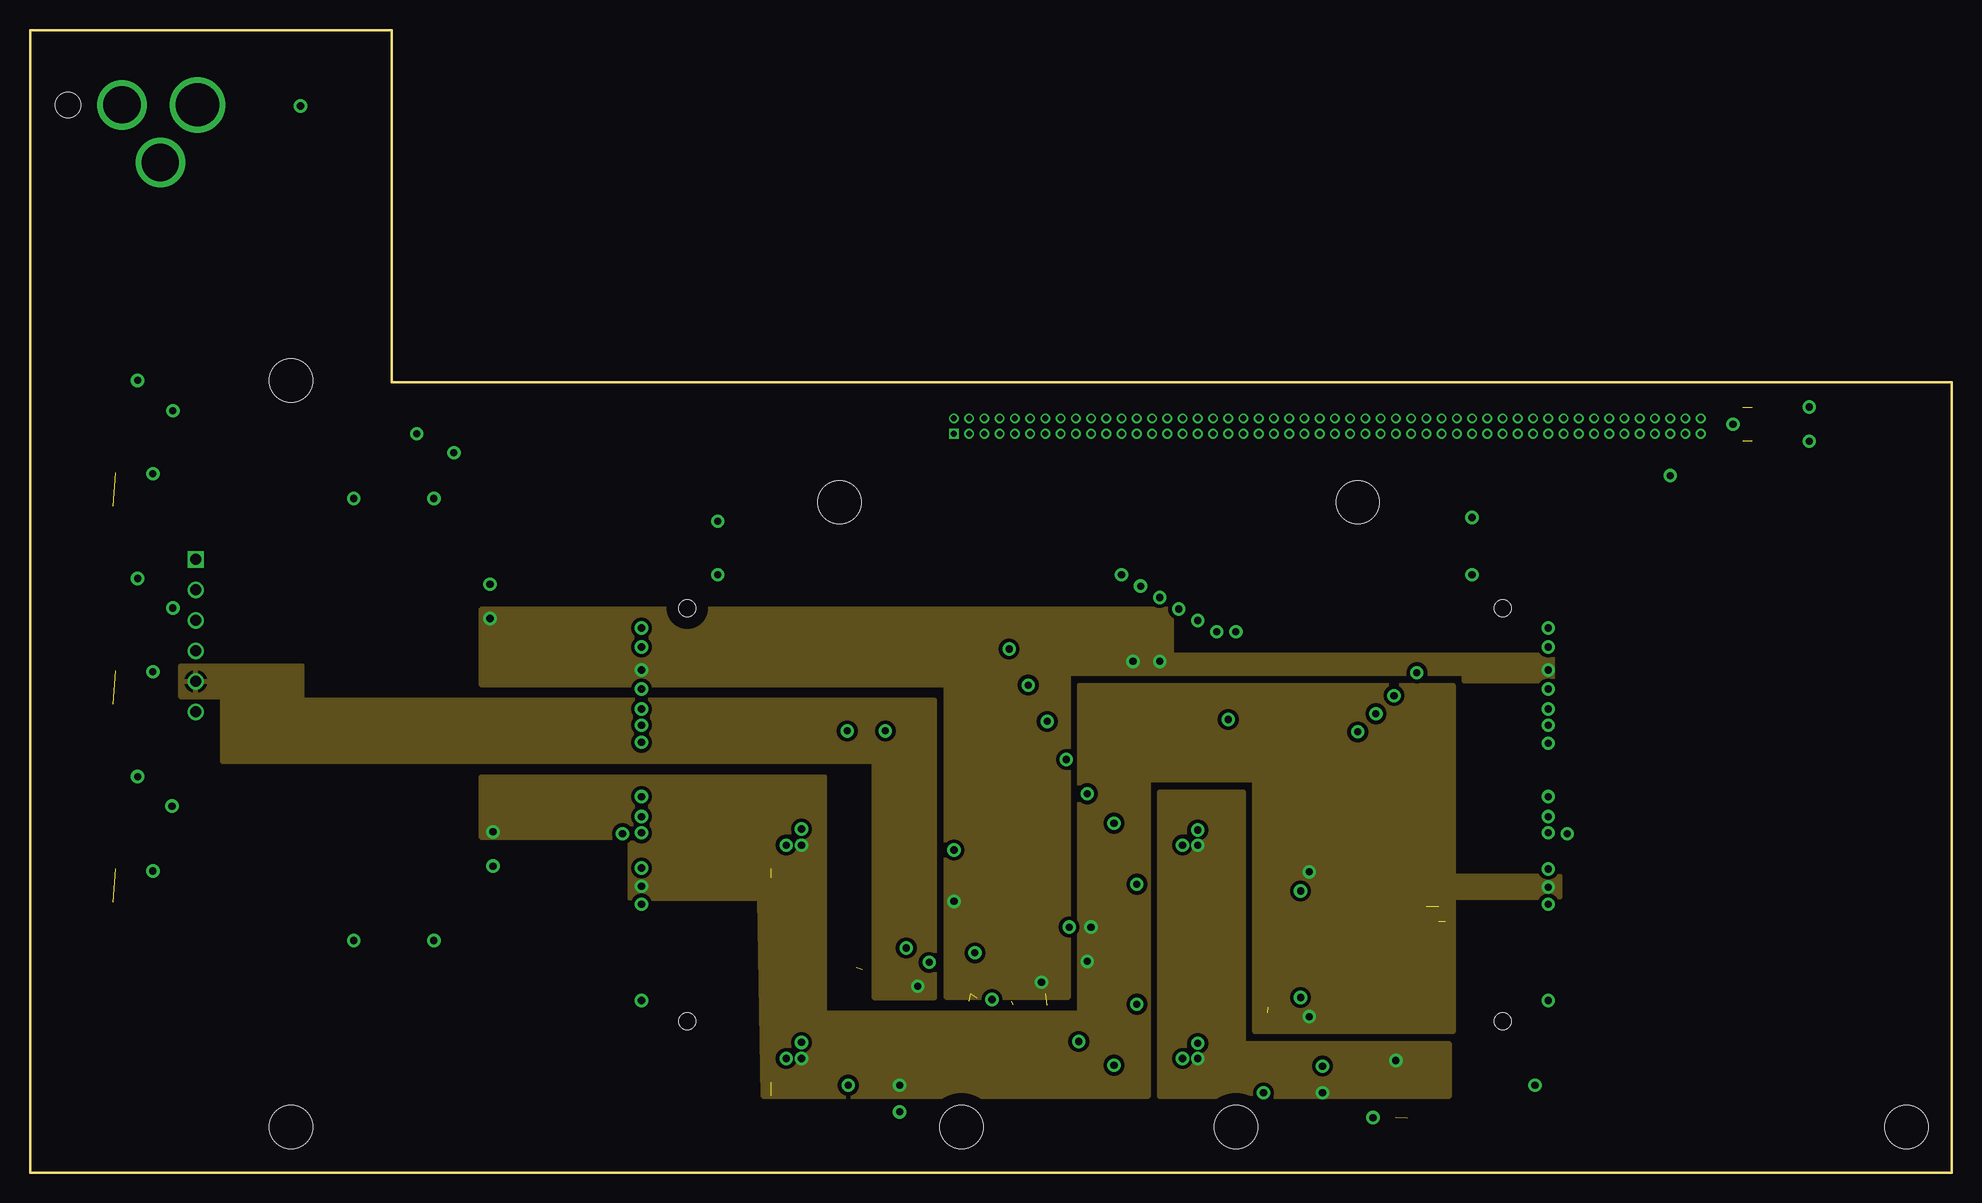
[diagram p7: board, inner layer Route3]
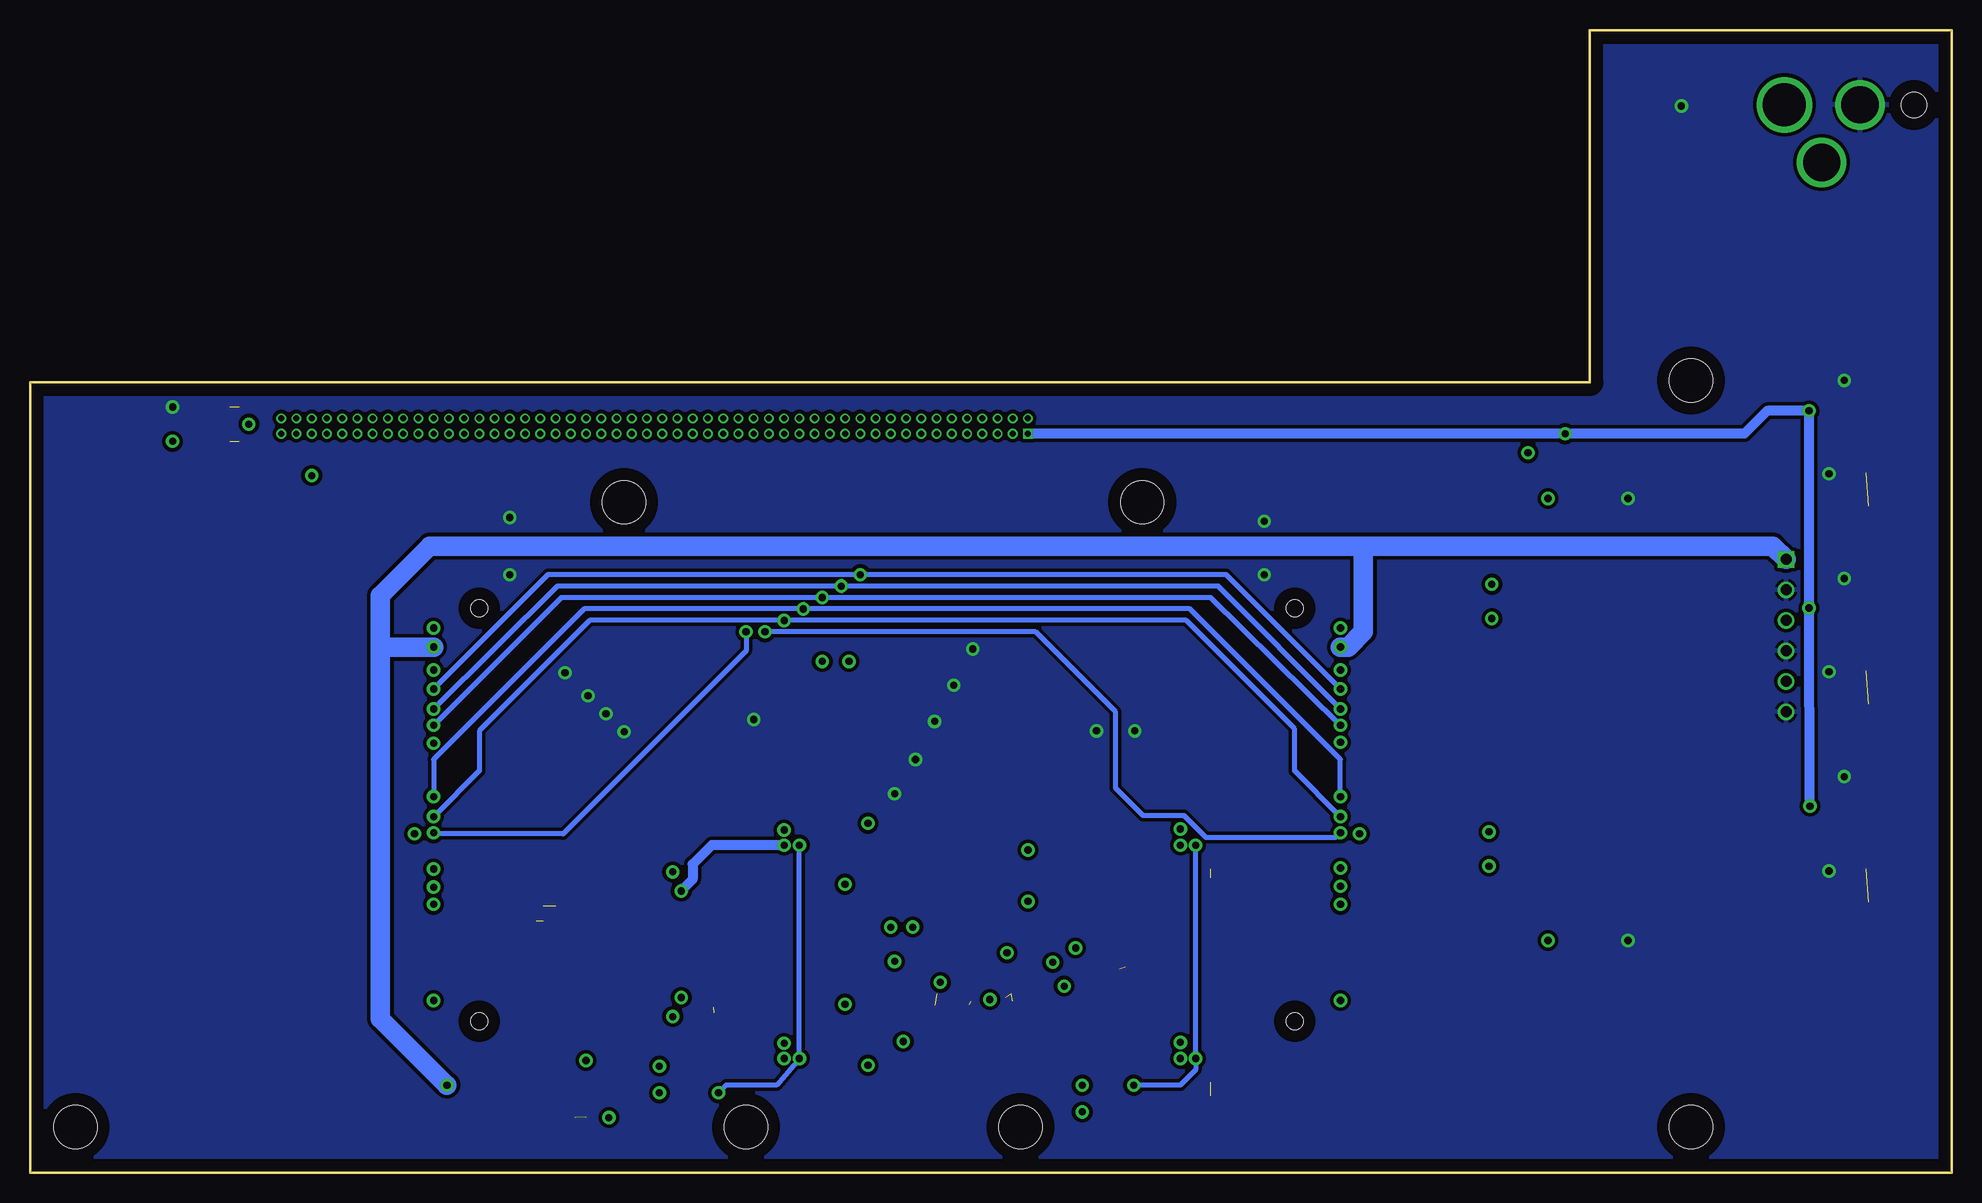
[diagram p8: board, bottom side, seen from below]

Size 160.16 x 95.24 mm. Coordinates in mm from the lower left corner, seen from the top.
Outline: 0,0 160.16,0 160.16,65.87 30.16,65.88 30.16,95.24 0,95.24 0,0
Copper layers ((1*2)+(3*16)): Top 0.035mm / dielectric 0.85mm / Route2 0.035mm / dielectric 0.15mm / Route3 0.035mm / dielectric 0.85mm / Bottom 0.035mm
Design rules "default *": minimum track width 6mil, minimum drill 15mil, track to track 6mil, track to pad 6mil, pad to pad 6mil, via to via 6mil, smd to smd 6mil, copper to edge 40mil, drill to drill 8mil, minimum pad ring 6mil, minimum via ring 10mil, stop-mask expansion 4mil, vias tented up to drill 0mil, thermal gap 10mil
Holes 3.6 mm at 156.37,3.81 21.75,3.81 21.75,66.04 77.63,3.81 100.49,3.81 110.65,55.88 67.47,55.88

### Footprints (pad centres in the part's own frame; a part is rotated, then mirrored left to right if it is on the bottom)
1206 = smd 1.6 x 1.803: 1 -1.422,0; 2 1.422,0
0603 = smd 1.1 x 1: 1 -0.85,0; 2 0.85,0
C3216 = smd 1.6 x 1.8: 1 -1.4,0; 2 1.4,0
JP6 = drill 0.914 square: 1 0,0 | drill 0.914 round: 2 2.54,0; 3 5.08,0; 4 7.62,0; 5 10.16,0; 6 12.7,0
SOIC8 = smd 0.6 x 2.2: 1 -1.905,-2.6; 2 -0.635,-2.6; 3 0.635,-2.6; 4 1.905,-2.6; 5 1.905,2.6; 6 0.635,2.6; 7 -0.635,2.6; 8 -1.905,2.6
TSSOP16 = smd 0.305 x 0.991: 1 -2.275,-2.918; 2 -1.625,-2.918; 3 -0.975,-2.918; 4 -0.325,-2.918; 5 0.325,-2.918; 6 0.975,-2.918; 7 1.625,-2.918; 8 2.275,-2.918; 9 2.275,2.918; 10 1.625,2.918; 11 0.975,2.918; 12 0.325,2.918; 13 -0.325,2.918; 14 -0.975,2.918; 15 -1.625,2.918; 16 -2.275,2.918
SO14 = smd 0.6 x 2.2: 1 -3.81,-2.6; 2 -2.54,-2.6; 3 -1.27,-2.6; 4 0,-2.6; 5 1.27,-2.6; 6 2.54,-2.6; 7 3.81,-2.6; 8 3.81,2.6; 9 2.54,2.6; 10 1.27,2.6; 11 0,2.6; 12 -1.27,2.6; 13 -2.54,2.6; 14 -3.81,2.6
853-XX-100-20-001000 = drill 0.5 square: 1 0,0 | drill 0.5 round: 2 0,1.27; 3 1.27,0; 4 1.27,1.27; 5 2.54,0; 6 2.54,1.27; 7 3.81,0; 8 3.81,1.27; 9 5.08,0; 10 5.08,1.27; 11 6.35,0; 12 6.35,1.27; 13 7.62,0; 14 7.62,1.27; 15 8.89,0; 16 8.89,1.27; 17 10.16,0; 18 10.16,1.27; 19 11.43,0; 20 11.43,1.27; 21 12.7,0; 22 12.7,1.27; 23 13.97,0; 24 13.97,1.27; 25 15.24,0; 26 15.24,1.27; 27 16.51,0; 28 16.51,1.27; 29 17.78,0; 30 17.78,1.27; 31 19.05,0; 32 19.05,1.27; 33 20.32,0; 34 20.32,1.27; 35 21.59,0; 36 21.59,1.27; 37 22.86,0; 38 22.86,1.27; 39 24.13,0; 40 24.13,1.27; 41 25.4,0; 42 25.4,1.27; 43 26.67,0; 44 26.67,1.27; 45 27.94,0; 46 27.94,1.27; 47 29.21,0; 48 29.21,1.27; 49 30.48,0; 50 30.48,1.27; 51 31.75,0; 52 31.75,1.27; 53 33.02,0; 54 33.02,1.27; 55 34.29,0; 56 34.29,1.27; 57 35.56,0; 58 35.56,1.27; 59 36.83,0; 60 36.83,1.27; 61 38.1,0; 62 38.1,1.27; 63 39.37,0; 64 39.37,1.27; 65 40.64,0; 66 40.64,1.27; 67 41.91,0; 68 41.91,1.27; 69 43.18,0; 70 43.18,1.27; 71 44.45,0; 72 44.45,1.27; 73 45.72,0; 74 45.72,1.27; 75 46.99,0; 76 46.99,1.27; 77 48.26,0; 78 48.26,1.27; 79 49.53,0; 80 49.53,1.27; 81 50.8,0; 82 50.8,1.27; 83 52.07,0; 84 52.07,1.27; 85 53.34,0; 86 53.34,1.27; 87 54.61,0; 88 54.61,1.27; 89 55.88,0; 90 55.88,1.27; 91 57.15,0; 92 57.15,1.27; 93 58.42,0; 94 58.42,1.27; 95 59.69,0; 96 59.69,1.27; 97 60.96,0; 98 60.96,1.27; 99 62.23,0; 100 62.23,1.27
71436-XX64 = smd 0.6 x 2.3: 1 -15.5,-1.85; 2 -14.5,-1.85; 3 -13.5,-1.85; 4 -12.5,-1.85; 5 -11.5,-1.85; 6 -10.5,-1.85; 7 -9.5,-1.85; 8 -8.5,-1.85; 9 -7.5,-1.85; 10 -6.5,-1.85; 11 -5.5,-1.85; 12 -4.5,-1.85; 13 -3.5,-1.85; 14 -2.5,-1.85; 15 -1.5,-1.85; 16 -0.5,-1.85; 17 0.5,-1.85; 18 1.5,-1.85; 19 2.5,-1.85; 20 3.5,-1.85; 21 4.5,-1.85; 22 5.5,-1.85; 23 6.5,-1.85; 24 7.5,-1.85; 25 8.5,-1.85; 26 9.5,-1.85; 27 10.5,-1.85; 28 11.5,-1.85; 29 12.5,-1.85; 30 13.5,-1.85; 31 14.5,-1.85; 32 15.5,-1.85; 33 -15.5,1.85; 34 -14.5,1.85; 35 -13.5,1.85; 36 -12.5,1.85; 37 -11.5,1.85; 38 -10.5,1.85; 39 -9.5,1.85; 40 -8.5,1.85; 41 -7.5,1.85; 42 -6.5,1.85; 43 -5.5,1.85; 44 -4.5,1.85; 45 -3.5,1.85; 46 -2.5,1.85; 47 -1.5,1.85; 48 -0.5,1.85; 49 0.5,1.85; 50 1.5,1.85; 51 2.5,1.85; 52 3.5,1.85; 53 4.5,1.85; 54 5.5,1.85; 55 6.5,1.85; 56 7.5,1.85; 57 8.5,1.85; 58 9.5,1.85; 59 10.5,1.85; 60 11.5,1.85; 61 12.5,1.85; 62 13.5,1.85; 63 14.5,1.85; 64 15.5,1.85 | hole 1.4: -17.2,0; 17.2,0
PJ-057AH = drill 3.6 round: 1 0,3.1 | drill 3.1 round: 2 0,-3.2; 3 4.8,0 | hole 2.1: 0,-7.7

### Placement (x,y rotation side)
B1  144.94,63.82 0 top
B2  30.32,19.37 180 top
B3  30.32,56.2 180 top
B4  NONE  [1206]  144.94,60.96 0 top
B101  MI1206K601R-10  [1206]  122.08,7.3 0 top
B111  32.23,43.5 270 top
B112  32.23,31.11 90 top
C11  200p  [0603]  64.93,35.56 0 top
C12  200p  [0603]  63.02,20.32 0 top
C21  200p  [0603]  63.02,17.78 0 top
C22  200p  [0603]  64.93,2.54 0 top
C31  67.47,20.95 180 top
C32  67.47,17.14 180 top
C33  76.99,14.92 0 top
C34  76.36,12.46 0 top
C35  76.99,24.77 270 top
C41  83.34,13.97 180 top
C42  83.34,11.75 0 top
C43  87.39,13.41 90 top
C51  95.41,35.56 0 top
C52  97.95,20.32 0 top
C61  97.95,17.78 0 top
C62  95.41,2.54 0 top
C101  6.51,66.04 0 top
C102  7.78,55.56 0 top
C103  10.32,60.64 270 top
C104  118.27,6.03 270 top
C105  116.05,6.03 270 top
C106  113.82,6.03 270 top
C111  6.51,49.53 0 top
C112  7.78,39.05 0 top
C113  10.32,44.13 270 top
C114  32.23,47.62 90 top
C115  34.45,47.62 90 top
C116  36.67,47.62 90 top
C117  32.23,26.99 270 top
C118  34.45,26.99 270 top
C119  36.67,26.99 270 top
C121  6.51,33.02 0 top
C122  7.78,22.54 0 top
C123  10.32,27.62 270 top
C200  19.21,88.9 0 top
JP1  13.81,51.12 270 top
LED2P5  5,22.3 270 top
LED3P3  5,38.81 270 top
LED5  5,55.32 270 top
LED6  18.89,91.52 0 top
R10  70.33,7.3 0 top
R11  499  [0603]  59.85,25.4 90 top
R12  499  [0603]  64.93,33.02 0 top
R13  68.74,27.3 0 top
R14  499  [0603]  59.85,20.32 0 top
R15  499  [0603]  63.02,22.86 0 top
R16  68.74,23.5 0 top
R20  70.33,5.08 180 top
R21  499  [0603]  59.85,17.78 0 top
R22  499  [0603]  63.02,15.24 0 top
R23  68.74,14.61 0 top
R24  499  [0603]  59.85,12.7 270 top
R25  499  [0603]  64.93,5.08 0 top
R26  68.74,10.79 0 top
R50  105.25,6.67 0 top
R51  90.33,26.67 90 top
R52  92.87,26.67 90 top
R53  45.3k  [0603]  95.41,33.02 0 top
R54  92.23,21.59 270 top
R55  94.77,21.59 90 top
R56  45.3k  [0603]  97.95,22.86 0 top
R60  105.25,8.89 180 top
R61  92.23,16.51 270 top
R62  94.77,16.51 270 top
R63  45.3k  [0603]  97.95,15.24 0 top
R64  90.33,11.43 90 top
R65  92.87,11.43 270 top
R66  45.3k  [0603]  95.41,5.08 0 top
R81  103.98,24.77 180 top
R82  109.38,24.77 270 top
R91  109.38,13.34 270 top
R92  103.98,13.34 0 top
R101  71.91,55.88 270 top
R102  73.5,52.07 90 top
R103  75.09,55.88 270 top
R104  76.68,52.07 90 top
R105  78.26,55.88 270 top
R106  79.85,52.07 270 top
R107  81.44,55.88 90 top
R108  83.03,52.07 90 top
R109  84.61,55.88 270 top
R110  86.2,52.07 90 top
R111  87.79,55.88 270 top
R112  89.38,52.07 270 top
R113  90.96,55.88 90 top
R114  95.73,52.07 270 top
R115  97.31,55.88 270 top
R116  98.9,52.07 90 top
R117  100.49,55.88 90 top
R118  102.71,55.88 90 top
R119  104.3,52.07 270 top
R120  105.89,55.88 270 top
R121  107.47,52.07 90 top
R123  91.92,44.77 270 top
R124  94.14,44.77 270 top
R200  33.1,60.01 180 top
RL2P5  7.78,20.24 180 top
RL3P3  7.7,36.75 180 top
RL5  7.7,53.26 180 top
RL6  402  [0603]  22.62,91.52 180 top
U1  63.66,27.94 0 top
U2  63.66,10.16 0 top
U3  74.45,19.05 270 top
U4  87.79,19.05 180 top
U5  96.68,27.94 0 top
U6  96.68,10.16 0 top
U7  105.57,19.05 180 top
U8  114.78,22.86 90 top
U9  114.78,15.24 90 top
U10  REG103UA-5-ND  [SOIC8]  6.51,60.96 0 top
U11  REG103UA-3.3-ND  [SOIC8]  6.51,44.45 0 top
U12  REG103UA-2.5-ND  [SOIC8]  6.51,27.94 0 top
X1  853-93-100-20-001000  [853-XX-100-20-001000]  76.99,61.59 0 top
X2  71436-2164  [71436-XX64]  54.77,29.84 270 top
X3  71436-2164  [71436-XX64]  122.71,29.84 270 top
X4  10.86,89 270 top

### Tracks (layer width: path | path; a pad name or v marks a point on that pad's centre or on a via)
ADC_CS
  Top 0.406: R109.2 84.61,39.69 83.5,38.58 83.5,26.51 82.55,25.56 82.55,19.37 80.61,17.43 U3.10
ADC_SCLK
  Top 0.406: R106.2 79.85,49.13 78.42,47.7 78.42,21.11 77.98,20.68 U3.15 | U3.15
ADC_SDOUT_A
  Top 0.406: U3.14 78.84,20.02 79.61,20.8 79.61,27.23 80.17,27.78 80.17,44.37 81.44,45.64 R107.1
ADC_SDOUT_B
  Top 0.406: U3.13 80.49,19.38 81.04,19.92 81.04,26.27 81.84,27.07 81.84,41.51 83.03,42.7 R108.1
AGND  (via drill 0.6)  (1 unrouted)
  Top 0.406: v64.29,10.87 U2.6 | v64.29,28.65 U1.6 | U3.11 76.42,18.07 75.88,17.54 v74.93,17.54 | U3.5 72.7,18.73 v73.02,18.73 | v97.31,28.57 U5.6 | v97.31,10.79 U6.6 | U7.11 105.57,14.92 v105.89,14.61 | 122.71,22.34 X3.56 126.48,22.34 v126.52,22.38 | X3.21 X3.53 126.5,25.34 v126.52,25.32 | X3.32 122.71,14.35 | 122.71,14.35 X3.64 126.5,14.35 v126.52,14.37 | X2.53 X2.21 52.86,25.4 v50.96,25.4 | 54.77,22.34 X2.24 52.88,22.38 v50.96,22.38 | 54.77,22.34 X2.56 | 54.77,14.35 X2.64 | 54.77,14.35 X2.32 50.98,14.35 v50.96,14.37 | 54.77,14.35 54.77,17.34 | 54.77,19.34 X2.59 | 54.77,19.34 54.77,22.34 | 54.77,17.34 X2.61 | 54.77,17.34 54.77,19.34 | 122.71,22.34 X3.24 | 122.71,17.34 122.71,19.34 | 122.71,17.34 X3.29 | 122.71,14.35 122.71,17.34 | 122.71,19.34 X3.27 | 122.71,19.34 122.71,22.34 | R20.1 v72.47,5.08 | R51.2 v90.33,29.13 | R54.1 v92.23,24.05 | v90.33,8.97 R64.1 | v92.23,14.05 R61.2 | C43.1 v87.39,10.95 | v87.39,10.95 | R60.1 v107.71,8.89
  Top 0.813: 114.78,4.6 115.33,5.16 116.02,5.16 C105.2 C104.2 | C117.2 C118.2 35.14,26.45 35.72,25.88 36.64,25.88 C119.2 36.7,25.56 | B4.2 v148.27,60.96 | v111.92,4.6 113.79,4.6 C106.2
  Top 1.626: 36.7,25.56 v38.58,25.56 | B2.1 v33.65,19.37
  pour Route2 (isolate 0.305): 92.55,38.42 99.22,38.42 99.22,33.34 101.76,33.34 101.76,28.89 116.52,28.97 116.52,26.35 145.57,26.35 145.57,61.91 159.23,61.91 159.23,0.64 30.96,1.27 30.96,26.35 58.58,26.35 58.58,27.94 60.17,27.94 60.17,32.07 61.44,32.07 61.44,33.02 62.39,33.02 62.39,36.83 75.33,36.83 75.33,13.26 88.19,13.26 88.19,30.48 92.55,30.48
AVDD  (via drill 0.6)
  Top 0.406: U1.3 v64.29,27.3 | U2.3 v64.29,9.53 | v88.42,20.48 88.11,20.8 U4.4 | v88.11,17.62 88.11,17.3 U4.13 88.11,14.99 C43.2 | 124.54,23.34 X3.23 X3.22 X3.54 X3.55 126.06,23.34 v126.52,23.81 125.97,24.37 124.38,24.37 | X2.55 X2.23 X2.22 | X2.22 X2.54 56.67,24.29 56.67,23.5 | X2.22 51.41,24.34 v50.96,23.89 51.51,23.34 52.94,23.34 | R10.2 v72.47,7.3 | R81.1 105.57,24.77 105.89,25.08 v106.6,25.08 107.13,25.61 R82.1 | R92.2 105.57,13.34 105.89,13.02 v106.6,13.02 107.13,12.48 R91.2
  Top 0.813: B112.1 C117.1 C118.1 35.06,28.16 35.64,28.73 36.64,28.73 C119.1 36.7,28.42
  Top 1.626: 36.7,28.42 v38.58,28.42
  pour Route3 (isolate 0.305): 87.47,40.64 118.59,40.64 118.59,24.77 127.48,24.77 127.48,22.94 118.59,22.94 118.59,11.75 102.08,11.75 102.08,32.7 93.19,32.7 93.19,6.35 61.12,6.35 60.8,22.86 50.01,22.86 50.01,27.94 37.62,27.94 37.62,33.02 66.2,33.02 66.2,13.34 87.47,13.34
AVDD5  (via drill 0.6)
  Top 0.406: U5.3 v97.31,27.3 | U6.3 v97.31,9.53 | U7.4 105.57,23.18 v105.89,23.5 | R50.2 v107.71,6.67
  Top 0.813: B101.1 119.54,7.3 119.12,6.88 C104.1 C105.1 116.02,6.91 115.33,6.91 114.8,7.43 C106.1 v113.82,9.37
  Bottom 0.813: v105.89,23.5 104.93,24.45 104.93,25.72 103.35,27.3 v97.31,27.3
  pour Route3 (isolate 0.305): 94.14,31.75 101.12,31.75 101.12,10.79 118.27,10.79 118.27,6.35 94.14,6.35
CLKOUT1  (via drill 0.6)  (1 unrouted)
  Top 0.406: X2.6 50.98,40.34 | v90.96,49.85 R113.1 | v126.52,40.32 124.59,40.32 X3.38
  Bottom 0.406: v126.52,40.32 117,49.85 v90.96,49.85 60.48,49.85 v50.96,40.32
DAC_SCLK
  Top 0.406: R112.2 89.38,30.96 88.26,29.84 88.26,23.97 87.47,23.18 86.52,23.18 86.16,22.82 U4.7
DAC_SDIN
  Top 0.406: U4.8 85.51,24.02 86.76,25.24 86.76,32.54 87.79,33.58 R111.2
DAC_SYNC
  Top 0.406: U4.10 86.16,16.86 83.98,18.1 83.98,24.77 85.09,25.88 85.09,35.56 86.2,36.67 R110.1
DACOUT1
  Top 0.152: X1.45 104.3,62.23 104.3,63.5 103.35,64.45 65.56,64.45 48.1,46.99 48.1,22.54 50.3,20.34 X2.26
DGND  (via drill 0.6)  (3 unrouted)
  Top 0.406: U3.12 78.27,18.73 v78.74,18.34 | U4.5 U4.6 86.81,20.66 v86.6,20.48 | C42.1 82.31,11.93 82.31,12.3 81.94,12.67 C41.2 81.91,14 | X3.2 X3.1 X3.33 126.47,45.34 v126.52,45.4 | X2.34 X2.33 X2.1 51.02,45.34 v50.96,45.4 | X3.19 X3.51 127.2,27.34 v128.11,28.26 | X2.51 X2.19 50.28,27.34 v49.37,28.26 | X3.42 X3.43 126.07,35.34 v126.52,35.8 125.97,36.35 124.46,36.35 | C34.2 77.21,13.23 78.26,14.29 | X2.10 51.43,36.34 v50.96,35.88 | C35.1 v76.99,26.91 | 81.76,14.29 81.6,14.45 v80.17,14.45 79.06,14.45 78.9,14.61
  Top 0.813: X1.96 X1.95 v136.68,58.1 | C114.2 C115.2 34.47,48.5 35.16,48.5 35.69,49.02 C116.2 36.7,49.05 | R200.1 v35.32,60.01
  Top 1.626: 36.7,49.05 v38.34,49.05 | B3.1 v33.65,56.2
  pour Route2 (isolate 0.305): 30.96,48.26 30.96,65.41 102.39,65.41 102.39,58.74 144.62,58.74 144.62,27.3 117.4,27.3 117.4,29.84 102.71,29.84 102.71,34.29 100.17,34.29 100.17,39.37 91.6,39.37 91.6,31.43 87.39,31.43 87.39,14.05 76.28,14.05 76.2,37.62 61.6,37.62 61.59,33.81 60.64,33.81 60.64,32.86 59.37,32.86 59.37,28.73 57.63,28.73 57.63,27.3 48.1,27.3 48.1,48.26
DVDD  (via drill 0.6)  (1 unrouted)
  Top 0.406: U4.12 U4.11 86.81,15.54 86.52,15.24 86.01,15.24 C41.1 84.74,12.67 84.38,12.3 84.38,11.93 C42.2 | U3.16 77.37,21.85 76.99,22.23 v76.99,22.62 C35.2 | X2.5 X2.4 51.39,42.34 v50.96,41.91 51.51,41.35 54.21,41.35 54.77,40.8 54.77,35.88 54.24,35.34 X2.11 | X3.37 X3.36 126.09,42.34 v126.52,41.91 125.97,41.35 124.46,41.35 | v84.3,15.88 84.3,15.24 84.61,14.92
  Top 0.813: B111.1 C114.1 C115.1 35.14,46.77 35.72,46.2 36.64,46.2 C116.1 36.7,46.2 | v91.92,42.62 R123.2 | v94.14,42.62 R124.2
  Top 1.626: 36.7,46.2 v38.34,46.2
  pour Route3 (isolate 0.305): 37.62,46.99 95.09,46.99 95.09,43.18 126.84,43.18 126.84,40.96 119.54,40.96 119.54,41.59 86.52,41.59 86.52,14.61 76.36,14.61 76.36,40.64 37.62,40.64
F2-200-IO_0
  Top 0.152: X1.28 94.14,62.23 94.14,60.96 95.73,59.37 R114.1
F2-200-IO_1
  Top 0.152: X1.30 95.41,62.23 95.41,60.96 98.9,57.47 R116.2
F2-200-IO_2
  Top 0.152: X1.29 94.77,60.96 97.31,58.42 R115.1
F2-200-IO_3
  Top 0.152: X1.31 96.04,60.96 99.22,57.78 100.17,57.78 100.49,57.47 R117.2
F2-200-IO_5
  Top 0.152: X1.33 97.31,61.28 100.49,58.1 102.08,58.1 102.71,57.47 R118.2
F2-200-IO_6
  Top 0.152: X1.36 99.22,62.23 99.22,60.33 100.81,58.74 103.66,58.74 104.3,58.1 R119.1
F2-200-IO_7
  Top 0.152: X1.38 100.49,62.23 100.49,60.96 101.44,60.01 105.89,60.01 107.47,58.42 R121.2
F2-200-IO_8
  Top 0.152: X1.37 99.85,60.64 101.12,59.37 104.62,59.37 105.89,58.1 R120.1
F_AGND  (via drill 0.6)  (2 unrouted)
  Top 0.813: 142.72,60.96 141.92,61.75 v141.92,62.39 141.92,63.02 142.72,63.82
  pour Route2 (isolate 0.305): 103.66,64.77 103.66,60.01 144.3,60.01 144.3,64.77
GND  (via drill 0.6)
  Top 0.813: B1.2 v148.27,63.82
  Top 1.626: v26.99,56.2 B3.2 | v26.99,19.37 B2.2
  other vias: 8.97,66.04 10.24,58.26 8.97,49.53 10.24,41.75 8.97,33.02 10.24,25.16 22.54,88.9 57.31,54.29 57.31,49.85 68.1,36.83 71.28,36.83 120.17,49.85 120.17,54.61 115.57,41.67 99.85,37.78 81.6,43.66 83.19,40.64 84.77,37.62 86.36,34.45 88.11,31.59 113.67,39.77 112.16,38.26 110.65,36.75
  pour Bottom (isolate 0.305): 0.16,95.25 30.64,95.25 30.64,66.04 159.54,66.04 159.54,0 0.16,0
  pour Route2 (isolate 0.305): 0.16,95.25 29.69,95.25 29.69,1.27 0.16,1.27
  pour Top (isolate 0.305): 0.16,95.25 30.32,95.25 30.32,65.72 160.18,65.72 160.18,65.41 160.18,-0.32 0.16,-0.32
INDEPSPLYV2P5  (via drill 0.6)
  Top 0.406: U3.9 77.37,16.7 C33.1 | C34.1 75.51,14.84 C33.1 | v73.98,15.56 74.61,14.92 C33.1 | U12.1 4.6,23.55 LED2P5.1
  Top 0.813: U12.1 U12.2 5.87,26.67 7.68,28.47 C123.1 12.99,28.47 16.67,32.15 16.67,39.37 15.08,40.96 JP1.5
  pour Route3 (isolate 0.305): 75.41,39.37 22.7,39.37 22.7,42.23 12.54,42.23 12.54,39.69 16.03,39.69 16.03,34.29 70.33,34.29 70.33,14.61 75.41,14.61
INDEPSPLYV3P3
  Top 0.406: U11.1 4.6,40.06 LED3P3.1
  Top 0.813: U11.1 U11.2 5.87,43.18 7.68,44.98 C113.1 12.76,44.98 JP1.3
  Top 1.626: 32.23,39.69 B112.2 | 32.23,39.69 B111.2 | 32.23,39.69 27.46,39.69 23.49,43.66 23.1,44.05 21.11,46.04 JP1.3
INDEPSPLYV5  (via drill 0.6)
  Top 0.406: X3.34 X3.35 126.05,43.34 v126.52,43.81 125.97,44.37 124.54,44.37 | X2.3 X2.2 51.49,44.34 v50.96,43.81 51.43,43.34 53.02,43.34 | U10.1 4.6,56.57 LED5.1
  Top 0.813: U10.1 U10.2 5.87,59.69 7.68,61.49 C103.1 11.06,61.49 13.81,58.74 JP1.1
  Top 1.626: v125.41,7.3 B101.2
  Bottom 1.626: 49.05,52.23 19.76,52.23 14.92,52.23 JP1.1 | 49.05,52.23 126.84,52.23 130.97,48.1 130.97,44.13 | v126.52,43.81 130.65,43.81 130.97,44.13 | v50.96,43.81 50.32,43.81 49.05,45.09 49.05,52.23 | 130.97,44.13 130.97,12.86 v125.41,7.3
INDEPSPLYV6
  Top 0.406: LED6.1 18.04,89.13 C200.1
  Top 0.813: C200.1 17.71,89 | U10.8 U10.7 5.87,64.77 5.56,65.09 5.56,65.94 C101.1 | 2.7,63.5 2.76,63.56 | 2.7,46.99 2.76,47.05 | C111.1 5.56,49.43 5.56,48.26 5.87,47.94 U11.7 U11.8 | U12.8 U12.7 5.87,31.43 5.56,31.75 5.56,32.92 C121.1 | 2.96,30.54 2.7,30.8
  Top 1.626: 17.71,89 X4.1 | C200.1 17.81,83.69 2.7,68.58 2.7,63.5 2.7,46.99 2.7,30.8 | 2.76,63.56 U10.8 | U12.8 2.96,30.54 | 2.76,47.05 U11.8
IO_RX_00
  Top 0.406: X2.50 57.87,28.34 59.93,30.4 59.93,31.99 62.23,34.29 62.23,36.91 63.26,37.94 66.04,37.94 78.26,50.09 R105.2
IO_RX_02
  Top 0.406: X2.48 58.13,30.34 59.05,31.27 59.05,32.46 61.36,34.77 61.36,37.86 62.86,39.37 65.56,39.37 76.68,50.48 R104.1
IO_RX_05
  Top 0.406: X2.45 58.59,33.34 60.48,35.24 60.48,38.97 62.31,40.8 65.09,40.8 75.09,50.8 R103.2
IO_RX_06
  Top 0.406: X2.44 58.24,34.34 59.61,35.72 59.61,40.01 61.83,42.23 64.61,42.23 73.5,51.12 R102.1
IO_RX_07
  Top 0.406: X2.43 57.89,35.34 58.74,36.2 58.74,41.04 61.36,43.66 64.06,43.66 71.91,51.44 R101.2
IO_TX_02
  Top 0.406: X3.16 115.47,30.34 102.71,43.1 R118.1
IO_TX_05
  Top 0.406: X3.13 115.48,33.34 104.3,44.61 R119.2
IO_TX_06
  Top 0.406: X3.12 117.58,34.34 105.89,46.04 R120.2
IO_TX_07
  Top 0.406: X3.11 119.67,35.34 107.47,47.47 R121.1
IOUTN_A
  Top 0.406: U9.1 118.59,13.34 118.9,13.65 118.9,14.61 119.54,15.24 120.76,15.24 X3.31
IOUTN_B
  Top 0.406: X3.25 119.47,21.34 119.22,21.59 119.22,22.86 118.59,23.5 U8.3
IOUTP_A
  Top 0.406: U9.3 118.9,15.88 119.38,16.35 120.86,16.35 X3.30
IOUTP_B  (1 unrouted)
  Top 0.406: X3.26 119.2,20.34 118.59,20.95 117.95,20.95
MSS_GP_IO_0
  Top 0.152: X1.8 80.17,62.23 80.17,60.96 79.22,60.01 74.45,60.01 71.91,57.47 R101.1
MSS_GP_IO_1
  Top 0.152: X1.7 80.8,60.96 79.22,59.37 75.41,59.37 73.5,57.47 R102.2
MSS_GP_IO_2
  Top 0.152: X1.10 81.44,62.23 81.44,60.96 79.14,58.66 76.28,58.66 75.09,57.47 R103.1
MSS_GP_IO_3
  Top 0.152: X1.9 82.07,60.96 79.14,58.02 77.23,58.02 76.68,57.47 R104.2
MSS_GP_IO_4
  Top 0.152: X1.12 82.71,62.23 82.71,60.96 78.48,56.73
  Top 0.203: R105.1 78.48,56.73
MSS_GP_IO_5
  Top 0.152: X1.14 83.98,62.23 83.98,60.96 80.8,57.78 80.33,57.78 79.85,57.31 R106.1
MSS_GP_IO_6
  Top 0.152: X1.13 84.61,60.96 81.44,57.78 R107.2
MSS_GP_IO_7
  Top 0.152: X1.15 85.88,60.96 83.03,58.1 R108.2
MSS_GP_IO_8
  Top 0.152: X1.18 86.52,62.23 86.52,60.96 84.61,59.05 R109.1
MSS_GP_IO_9
  Top 0.152: X1.17 87.15,60.96 86.2,60.01 R110.2
MSS_GP_IO_10
  Top 0.152: X1.20 87.79,62.23 R111.1
MSS_GP_IO_11
  Top 0.152: X1.22 89.06,62.23 89.06,60.96 89.38,60.64 R112.1
MSS_GP_IO_13
  Top 0.152: R113.2 X1.23
MSS_GP_IO_14  (via drill 0.6)
  Top 0.152: X1.26 91.6,62.23 91.6,60.96 92.55,60.01 v92.55,48.9
  Top 0.406: v126.52,38.66 126.21,38.34 X3.40 | R123.1 91.92,48.26 v92.55,48.9 | v50.96,38.66 51.27,38.34 X2.8
  Bottom 0.406: v50.96,38.66 61.12,48.9 v92.55,48.9 116.2,48.9 v126.52,38.66
MSS_GP_IO_15  (via drill 0.6)
  Top 0.152: X1.25 92.23,60.96 94.14,59.05 v94.14,47.94
  Top 0.406: X2.9 51,37.34 v50.96,37.31 | v126.52,37.31 124.6,37.31 X3.41 | v94.14,47.94 R124.1
  Bottom 0.406: v50.96,37.31 61.75,47.94 v94.14,47.94 115.89,47.94 v126.52,37.31
N$1
  Top 0.406: U7.13 108.11,17.46 107.47,18.1 103.66,18.1 103.03,18.73 100.49,18.73 99.54,17.78 C61.2 R63.2 98.58,15.03 U6.5
N$2
  Top 0.406: U7.5 104.3,23.18 103.13,24.34 R81.2 103.35,24.98 103.35,25.4 104.62,26.67 110.33,26.67 112.18,24.82 U8.5 U8.6
N$3
  Top 0.406: LED2P5.2 5.71,21.45 RL2P5.2
N$4
  Top 0.406: U3.1 71.54,25.36 R13.2
N$5
  Top 0.406: U7.6 103.03,20.64 102.39,20 101.12,20 100.33,20.8 100.33,28.79 U5.5 98.58,32.07 97.63,33.02 R53.2 C51.2
N$6
  Top 0.406: C11.2 R12.2 65.56,32.8 U1.5 65.56,29.37 67.63,27.3 R13.1
N$7
  Top 0.406: C12.2 R15.2 64.29,22.86 65.56,24.13 U1.4 65.56,24.53 66.91,24.53 66.91,24.47 R16.1
N$8
  Top 0.406: C11.1 R12.1 64,32.94 63.02,32.94 61.75,31.67 U1.8 61.75,28.89 59.85,26.99 R11.2
N$9  (1 unrouted)
  Top 0.406: R14.2 C12.1 R15.1 62.17,23.55 61.75,23.97 61.75,24.61
N$10
  Top 0.406: C21.2 R22.2 64.37,15.24 65.56,14.05 65.56,13.57 | U2.5 65.56,13.57 | R23.1 66.86,13.57 65.56,13.57
N$11
  Top 0.406: R21.2 C21.1 R22.1 62.15,15.22 62.15,14.61 61.75,14.21 U2.8
N$12  (1 unrouted)
  Top 0.406: R24.2 59.85,11.03 61.75,9.13 61.75,6.43 63.05,5.14 64.02,5.14 R25.1 C22.1
N$13
  Top 0.406: C22.2 R25.2 65.56,5.29 U2.4 65.56,8.73 67.39,10.56 67.65,10.56 R26.1
N$14
  Top 0.406: U7.7 101.76,26.35 102.71,27.3 114.46,27.3 117,24.77 U8.4
N$15
  Top 0.406: U7.2 108.11,20.64 107.47,20 103.66,20 103.03,19.37 100.49,19.37 99.54,20.32 C52.2 R56.2 98.58,23.07 U5.4
N$16
  Top 0.406: U7.9 103.03,17.46 102.39,18.1 101.12,18.1 100.33,17.3 100.33,9.37 98.58,7.62 U6.4 98.58,6.35 97.31,5.08 R66.2 C62.2
N$17
  Top 0.406: C61.1 R63.1 96.04,15.24 95.62,15.66 R62.2 U6.8
N$18
  Top 0.406: C62.1 R66.1 94.77,5.29 U6.1 92.87,9.46 R65.2
N$19
  Top 0.406: C51.1 R53.1 94.77,32.8 U5.8 94.52,30.54 92.87,28.89 R52.2
N$20
  Top 0.406: C52.1 R56.1 96.04,22.86 95.62,22.44 R55.2 U5.1
N$21
  Top 0.406: R52.1 R51.1 90.33,23.57 89.41,22.66 U4.2
N$22
  Top 0.406: U7.3 106.84,22.86 107.89,23.91 R82.2 111.07,22.23 U8.7 U8.8
N$23
  Top 0.406: U4.15 89.41,15.52 90.33,14.61 R64.2 R65.1
N$24
  Top 0.406: R62.1 R61.1 92.21,17.38 90.73,17.38 90.06,16.72 U4.16
N$25
  Top 0.406: R55.1 R54.2 92.21,20.72 90.73,20.72 90.06,21.3 U4.1
N$26  (1 unrouted)
  Top 0.406: U7.1 109.38,20.32 109.7,20 115.09,20 115.73,20.64 115.73,21.59 116.36,22.23
N$27
  Top 0.406: U7.14 109.38,17.78 109.7,18.1 116.42,18.1 U9.4
N$28
  Top 0.406: U7.8 101.76,12.06 103.03,10.79 114.14,10.79 115.73,12.38 115.73,14.29 116.05,14.61 U9.2
N$29
  Top 0.406: LED3P3.2 5.64,37.96 RL3P3.2
N$30
  Top 0.406: U3.8 71.54,12.74 R26.2
N$31
  Top 0.406: U3.3 70.3,20.02 69.37,20.95 C31.1
N$32  (1 unrouted)
N$33
  Top 0.406: U9.5 U9.6 111.07,15.88 R91.1 107.89,14.19 106.84,15.24 U7.12
N$34  (1 unrouted)
  Top 0.406: U9.7 U9.8 112.18,13.28 110.33,11.43 104.62,11.43 103.35,12.7 103.35,13.12 R92.1 | U7.10 104.3,14.92 103.19,13.81
N$36  (1 unrouted)
N$37  (1 unrouted)
N$38
  Top 0.406: LED5.2 5.64,54.47 RL5.2
N$39
  Top 0.406: U3.7 70.92,17.43 70.33,16.83 70.33,15.34 R23.2
N$40
  Top 0.406: U3.2 70.92,20.68 70.33,21.27 70.33,22.76 R16.2
N$41
  Top 0.406: LED6.2 RL6.2 | RL6.2
S$2
  Top 0.406: C32.2 66.07,18.97 | 66.07,18.97 C31.2 | 66.07,18.97 70.02,18.97 70.02,18.98 70.41,19.37 71.53,19.37 U3.4
S$3  (1 unrouted)
  Top 0.406: U3.6 70.46,18.07 69.37,16.99
SCLK  (via drill 0.6)
  Top 0.406: X2.15 v50.97,31.34 v50.96,31.35 | v95.73,46.99 R114.2 | v126.52,31.35 124.57,31.35 X3.47
  Bottom 0.406: v50.96,31.35 50.96,34.45 63.5,46.99 v95.73,46.99 113.98,46.99 126.52,34.45 v126.52,31.35
SDI  (via drill 0.6)
  Top 0.406: v97.31,46.04 R115.2 | v126.52,29.69 126.21,29.37 124.59,29.37 X3.49 | v50.96,29.69 51.3,29.34 X2.17
  Bottom 0.406: v50.96,29.69 54.77,33.5 54.77,36.99 63.82,46.04 v97.31,46.04 113.51,46.04 122.71,36.83 122.71,33.5 v126.52,29.69
SEN_RX  (via drill 0.6)
  Top 0.406: X2.18 v50.97,28.34 v50.96,28.34 | v98.9,45.09 R116.1
  Bottom 0.406: v98.9,45.09 76.36,45.09 69.69,38.42 69.69,32.07 67.39,29.77 63.98,29.77 62.15,27.94 51.36,27.94 v50.96,28.34
SEN_TX  (via drill 0.6)  (1 unrouted)
  Top 0.406: v100.49,45.09 R117.1 | X3.50 v126.52,28.34
  Bottom 0.406: v100.49,45.09 100.49,43.5 115.73,28.26 126.44,28.26 v126.52,28.34
V3P3
  Top 0.813: X1.97 X1.98 X1.100 X1.99 X1.97
V_BIAS  (via drill 0.6)
  Top 0.406: v63.02,27.3 U1.2 | U2.2 v63.02,9.53 | R20.2 R10.1 v68.18,7.3
  Bottom 0.406: v63.02,27.3 v63.02,9.53 63.02,8.57 64.29,7.3 v68.18,7.3
V_BIAS2  (via drill 0.6)
  Top 0.406: v96.04,27.3 U5.2 | U6.2 v96.04,9.53 | R60.2 R50.1 v102.79,6.67
  Bottom 0.406: v96.04,27.3 v96.04,9.53 97.95,7.3 102.16,7.3 v102.79,6.67
VINN_A
  Top 0.406: R21.1 59,17.41 57.94,16.35 X2.62
VINN_B
  Top 0.406: X2.58 58.97,20.34 R14.1
VINP_A
  Top 0.406: X2.63 58.05,15.35 R24.1
VINP_B
  Top 0.406: R11.1 59.85,23.34 57.86,21.35 56.63,21.35 X2.57
VUSB  (via drill 0.6)
  Top 0.406: 8.43,47.07 U11.5 | U12.5 8.43,30.56
  Top 0.813: v11.91,63.5 8.47,63.5 U10.5 | v32.23,61.59 32.23,60.03 R200.2 | v11.91,47.07 8.43,47.07 | 8.43,30.56 v11.83,30.56 | X1.1 X1.2 X1.4 X1.3 X1.1
  Bottom 0.813: v11.83,30.56 v11.91,47.07 v11.91,63.5 15.4,63.5 17.3,61.59 v32.23,61.59 X1.1

### Text on the board
tPlace: 6V DC | 0-3.5A | BEAVERBOARD | Rev A | (2011) | 5V | GND | 3.3V | GND | 2.5V | GND
SmartFusionEval: SmartFusion | evaluation | board
RFX400: RFX400